# Altium project RK3566.PrjPcb (part 3 of 3)

## Sheet POWER_PMIC.SchDoc
size A3; SheetNumber: 11; SheetTotal: 20
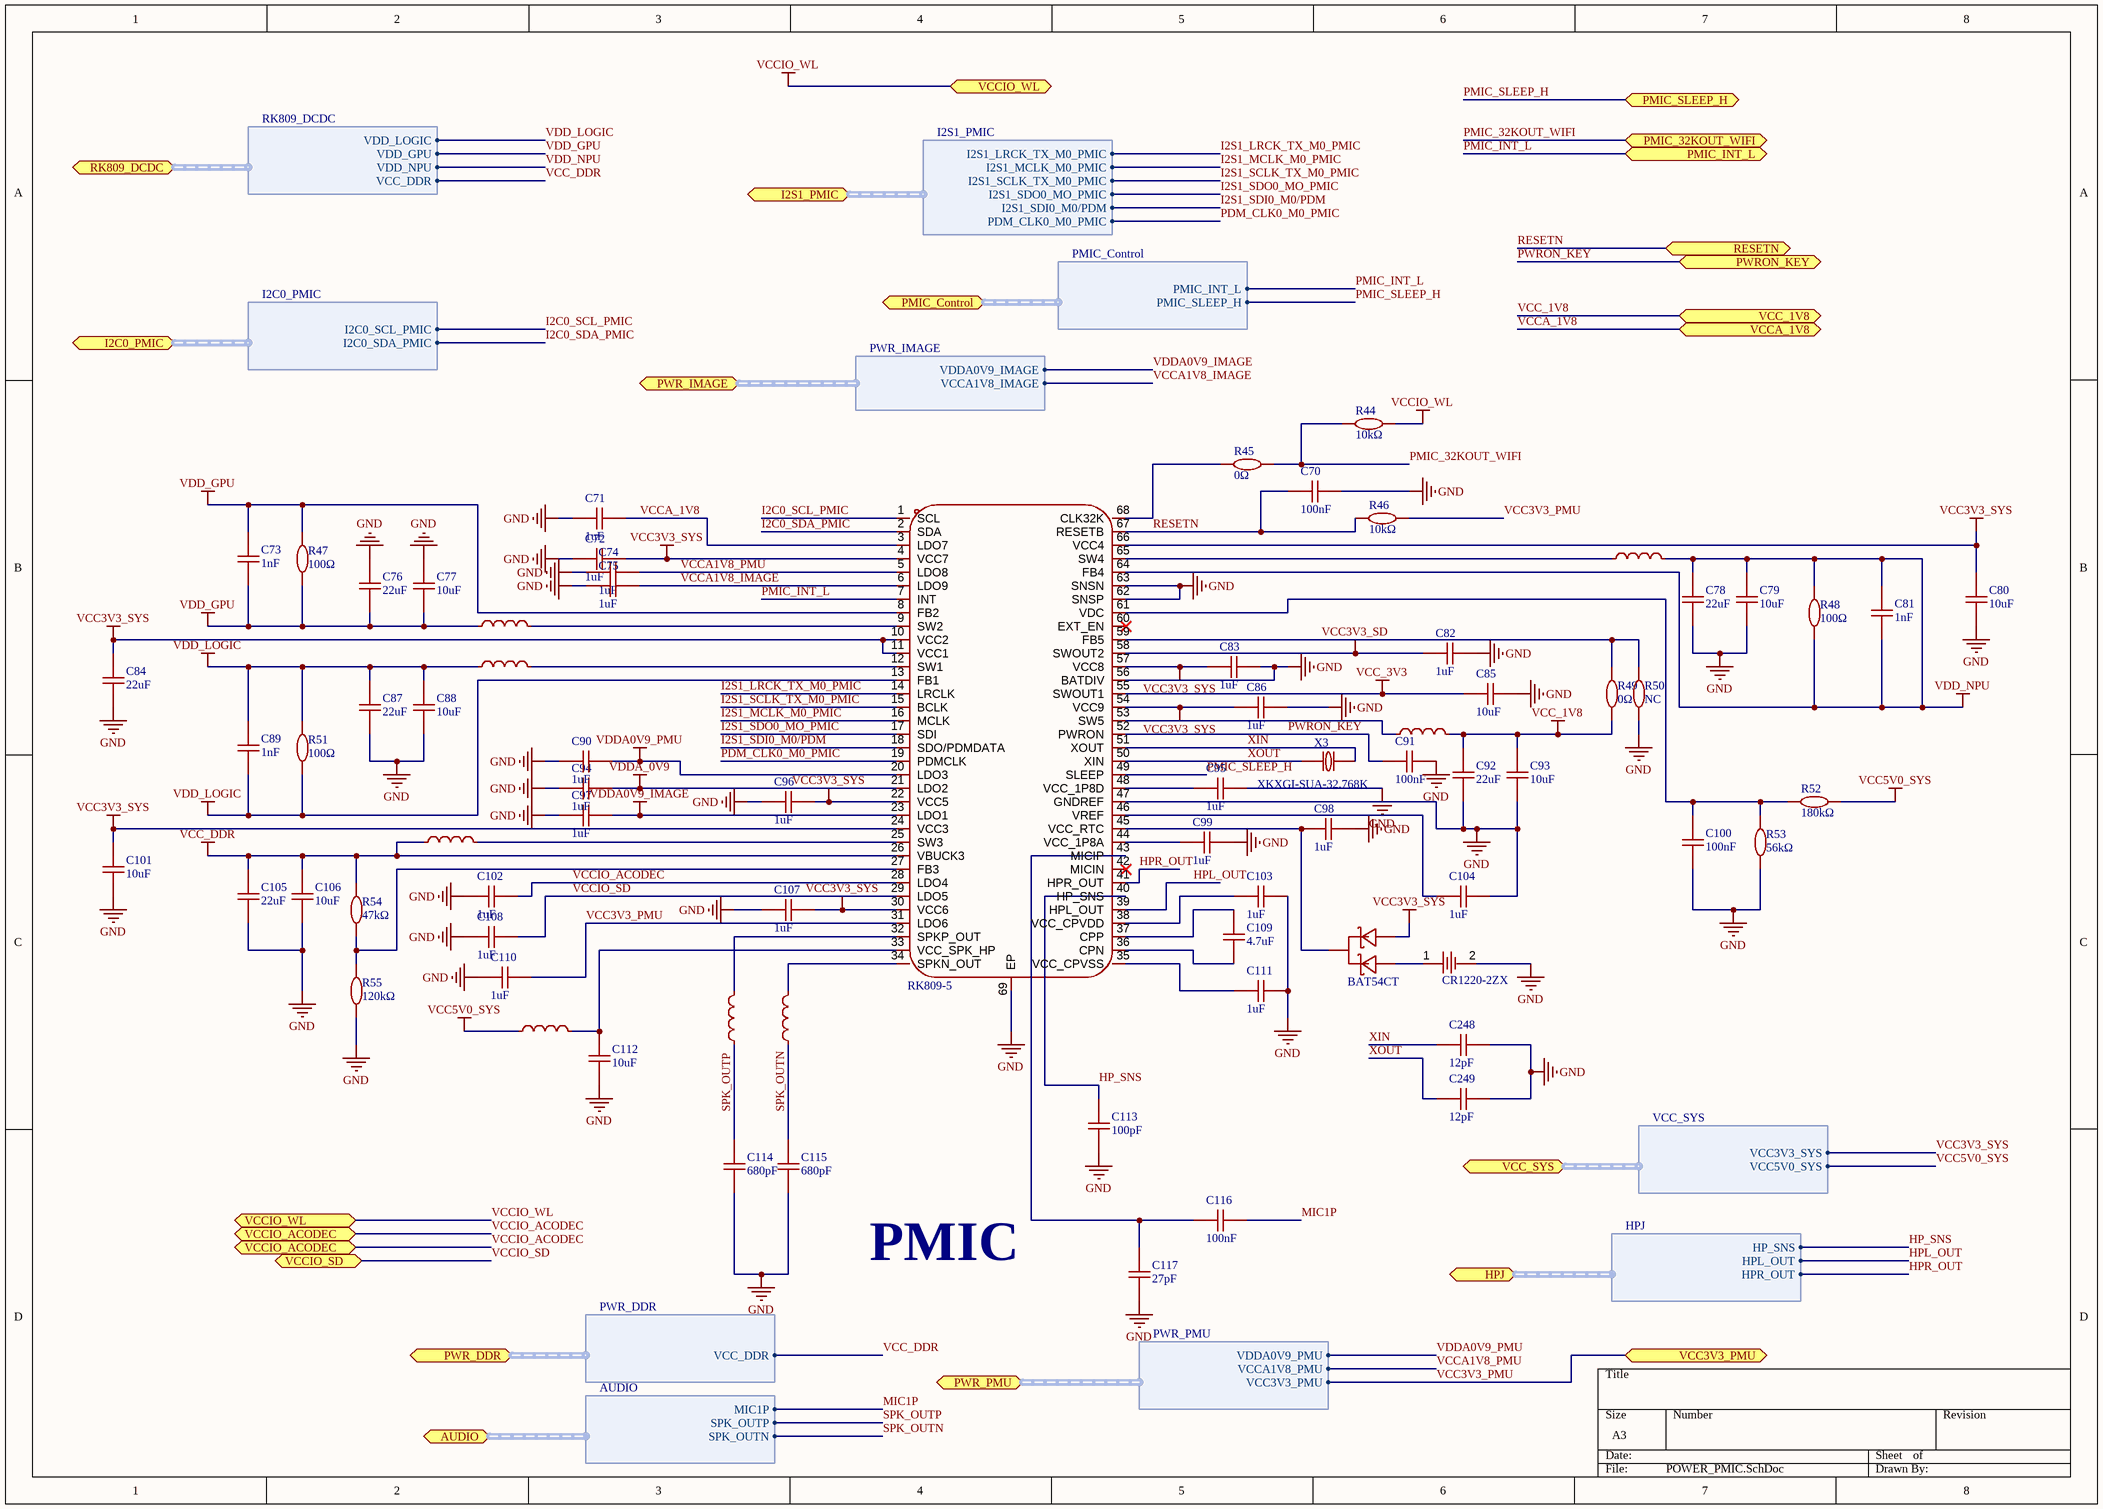
[diagram p14: POWER_PMIC.SchDoc]

### Parts
BT1  CR1220-2ZX  [BAT-SMD_CR1220-2ZX]
C70  100nF  [C0402]
C71  1uF  [C0402]
C72  1uF  [C0402]
C73  1nF  [C0402]
C74  1uF  [C0402]
C75  1uF  [C0402]
C76  22uF  [C0603]
C77  10uF  [C0603]
C78  22uF  [C0603]
C79  10uF  [C0603]
C80  10uF  [C0603]
C81  1nF  [C0402]
C82  1uF  [C0402]
C83  1uF  [C0402]
C84  22uF  [C0603]
C85  10uF  [C0603]
C86  1uF  [C0402]
C87  22uF  [C0603]
C88  10uF  [C0603]
C89  1nF  [C0402]
C90  1uF  [C0402]
C91  100nF  [C0402]
C92  22uF  [C0603]
C93  10uF  [C0603]
C94  1uF  [C0402]
C95  1uF  [C0402]
C96  1uF  [C0402]
C97  1uF  [C0402]
C98  1uF  [C0402]
C99  1uF  [C0402]
C100  100nF  [C0402]
C101  10uF  [C0603]
C102  1uF  [C0402]
C103  1uF  [C0402]
C104  1uF  [C0402]
C105  22uF  [C0603]
C106  10uF  [C0603]
C107  1uF  [C0402]
C108  1uF  [C0402]
C109  4.7uF  [C0402]
C110  1uF  [C0402]
C111  1uF  [C0402]
C112  10uF  [C0603]
C113  100pF  [C0402]
C114  680pF  [C0402]
C115  680pF  [C0402]
C116  100nF  [C0402]
C117  27pF  [C0402]
C248  12pF  [C0402]
C249  12pF  [C0402]
D9  BAT54CT  [SOT-523-3_L1.6-W0.8-P1.00-LS1.6-BR]
L3  470nH  [IND-SMD_L2.0-W1.6_MHCHL201610A-1R0M-Q8A]  (value not drawn)
L4  470nH  [IND-SMD_L2.0-W1.6_MHCHL201610A-1R0M-Q8A]  (value not drawn)
L5  470nH  [IND-SMD_L2.0-W1.6_MHCHL201610A-1R0M-Q8A]  (value not drawn)
L6  470nH  [IND-SMD_L2.0-W1.6_MHCHL201610A-1R0M-Q8A]  (value not drawn)
L7  470nH  [IND-SMD_L2.0-W1.6_MHCHL201610A-1R0M-Q8A]  (value not drawn)
L8  180Ω  [L0603]  (value not drawn)
L9  180Ω  [L0603]  (value not drawn)
L10  180Ω  [L0603]  (value not drawn)
R44  10kΩ  [R0402]
R45  0Ω  [R0402]
R46  10kΩ  [R0402]
R47  100Ω  [R0402]
R48  100Ω  [R0402]
R49  0Ω  [R0402]
R50  NC  [R0402]
R51  100Ω  [R0402]
R52  180kΩ  [R0402]
R53  56kΩ  [R0402]
R54  47kΩ  [R0402]
R55  120kΩ  [R0402]
U20  RK809-5  [QFN-68_L7.0-W7.0-P0.35-BL-EP5.5]
X3  XKXGI-SUA-32.768K  [CRYSTAL-SMD_L3.2-W1.5-1]

### Ports
AUDIO (bidir, harness AUDIO, see POWER[3D], Audio_AND_HPJ[1A], POWER[3D]), HPJ (bidir, harness HPJ, see POWER[3D], Audio_AND_HPJ[3C], POWER[3D]), I2C0_PMIC (bidir, harness I2C0_PMIC, see POWER[4C], POWER[4D], POWER_EXTENSION[4A], RK3566[3D], RK3566_OSC_PLL_PMUO1_2[5A]), I2S1_PMIC (bidir, harness I2S1_PMIC, see POWER[2D], RK3566[3B], RK3566_FLASH_SD_SARADC[6C]), PMIC_32KOUT_WIFI (bidir, see POWER[3D], Wi-Fi_BT[6C]), PMIC_Control (bidir, harness PMIC_Control, see POWER[3D], RK3566[3D], RK3566_OSC_PLL_PMUO1_2[1A]), PMIC_INT_L (bidir, see POWER[3D], RK3566[3D], RK3566_OSC_PLL_PMUO1_2[2B]), PMIC_SLEEP_H (bidir, see POWER[4C], POWER[4D], POWER_EXTENSION[1A], RK3566[3D], RK3566_OSC_PLL_PMUO1_2[2B]), PWR_DDR (bidir, harness PWR_DDR, see POWER[3D], POWER_FLASH_POWER_MANAGE[3B], RK3566[2A], RK3566_DDR_PHY[1A]), PWR_IMAGE (bidir, harness PWR_IMAGE, see POWER[2C], POWER[1C], RK3566[3C], RK3566_MIPI_HDMI[5D], RK3566_USB_GPIO[1B]), PWR_PMU (bidir, harness PWR_PMU, see POWER[2D], LPDDR4[4C], POWER[2D], RK3566[3C], RK3566_OSC_PLL_PMUO1_2[1A]), PWRON_KEY (bidir, see POWER[2C], DEBUG_AND_GPIO[8B], POWER[1C]), RESETN (bidir, see POWER[2C], DEBUG_AND_GPIO[8D], POWER[1C], RK3566[3C], RK3566_OSC_PLL_PMUO1_2[2B]), RK809_DCDC (bidir, harness RK809_DCDC, see POWER[3D], RK3566[3D], RK3566_POWER[2A]), VCC3V3_PMU (bidir, see POWER[3C], POWER_EXTENSION[1A], POWER_FLASH_POWER_MANAGE[3A]), VCC_1V8 (bidir, see POWER[3C], POWER_FLASH_POWER_MANAGE[3A]), VCC_SYS (bidir, harness VCC_SYS, see POWER[3C], Audio_AND_HPJ[3A], DEBUG_AND_GPIO[1D], HDMI[2C], MIPI_DSI_TP[6A], POWER[3B], POWER[6B], POWER_EXTENSION[4D], POWER_FLASH_POWER_MANAGE[3C], Wi-Fi_BT[3D]), VCCA_1V8 (bidir, see POWER[2C], DEBUG_AND_GPIO[5C], POWER[1C], RK3566[3C], RK3566_USB_GPIO[6C]), VCCIO_ACODEC (bidir, see POWER[3D], RK3566[3B], RK3566_FLASH_SD_SARADC[7C]), VCCIO_SD (bidir, see POWER[3D], RK3566[3B], RK3566_FLASH_SD_SARADC[7C]), VCCIO_WL (bidir, see POWER[4C], POWER[4D], POWER_EXTENSION[1A], RK3566[3B], RK3566_FLASH_SD_SARADC[7C])

### Harnesses
RK809_DCDC: VDD_LOGIC, VDD_GPU, VDD_NPU, VCC_DDR
I2C0_PMIC: I2C0_SCL_PMIC, I2C0_SDA_PMIC
I2S1_PMIC: I2S1_MCLK_M0_PMIC, I2S1_SCLK_TX_M0_PMIC, I2S1_SDO0_MO_PMIC, I2S1_SDI0_M0/PDM, I2S1_LRCK_TX_M0_PMIC, PDM_CLK0_M0_PMIC
PMIC_Control: PMIC_INT_L, PMIC_SLEEP_H
AUDIO: SPK_OUTP, SPK_OUTN, MIC1P
HPJ: HPL_OUT, HPR_OUT, HP_SNS
PWR_DDR: VCC_DDR
PWR_IMAGE: VDDA0V9_IMAGE, VCCA1V8_IMAGE
PWR_PMU: VCCA1V8_PMU, VDDA0V9_PMU, VCC3V3_PMU
VCC_SYS: VCC3V3_SYS, VCC5V0_SYS

### Nets
GND: BT1.2 C70.2 C71.2 C72.2 C74.2 C75.2 C76.2 C77.2 C78.1 C79.1 C80.1 C82.1 C83.2 C84.1 C85.1 C86.2 C87.1 C88.1 C90.2 C91.2 C92.1 C93.1 C94.2 C95.2 C96.2 C97.2 C98.1 C99.2 C100.1 C101.1 C102.2 C103.1 C104.1 C105.1 C106.1 C107.2 C108.2 C110.2 C111.2 C112.1 C113.1 C114.1 C115.1 C117.1 C248.2 C249.2 R50.2 R53.1 R55.1 U20.47(GNDREF) U20.56(BATDIV) U20.62(SNSP) U20.63(SNSN) U20.69(EP)
VCC3V3_PMU: C110.1 R46.2 U20.31(LDO6) ; port VCC3V3_PMU, port PWR_PMU.VCC3V3_PMU
VCC3V3_SD: C82.2 U20.58(SWOUT2)
VCC3V3_SYS: C72.1 C80.2 C83.1 C84.2 C86.1 C96.1 C101.2 C107.1 D9.2(A) U20.4(VCC7) U20.10(VCC2) U20.11(VCC1) U20.22(VCC5) U20.24(VCC3) U20.30(VCC6) U20.54(VCC9) U20.57(VCC8) U20.66(VCC4) ; port VCC_SYS.VCC3V3_SYS
VCC5V0_SYS: L10.1 R52.2 ; port VCC_SYS.VCC5V0_SYS
VCC_1V8: C92.2 C93.2 L6.2 R49.1 ; port VCC_1V8
VCC_3V3: C85.2 U20.55(SWOUT1)
VCC_DDR: C105.2 C106.2 L7.1 R54.2 U20.26(VBUCK3) ; port RK809_DCDC.VCC_DDR, port PWR_DDR.VCC_DDR
VCCA1V8_IMAGE: C75.1 U20.6(LDO9) ; port PWR_IMAGE.VCCA1V8_IMAGE
VCCA1V8_PMU: C74.1 U20.5(LDO8) ; port PWR_PMU.VCCA1V8_PMU
VCCA_1V8: C71.1 U20.3(LDO7) ; port VCCA_1V8
VCCIO_ACODEC: C102.1 U20.28(LDO4) ; port VCCIO_ACODEC
VCCIO_SD: C108.1 U20.29(LDO5) ; port VCCIO_SD
VCCIO_WL: R44.2 ; port VCCIO_WL
VDD_GPU: C73.1 C73.2 C76.1 C77.1 L4.1 R47.1 R47.2 U20.8(FB2) ; port RK809_DCDC.VDD_GPU
VDD_LOGIC: C87.2 C88.2 C89.1 C89.2 L5.1 R51.1 R51.2 U20.13(FB1) ; port RK809_DCDC.VDD_LOGIC
VDD_NPU: C78.2 C79.2 C81.1 C81.2 L3.2 R48.1 R48.2 U20.64(FB4) ; port RK809_DCDC.VDD_NPU
VDDA0V9_IMAGE: C97.1 U20.23(LDO1) ; port PWR_IMAGE.VDDA0V9_IMAGE
VDDA0V9_PMU: C90.1 U20.20(LDO3) ; port PWR_PMU.VDDA0V9_PMU
VDDA_0V9: C94.1 U20.21(LDO2)
HP_SNS: C113.2 U20.40(HP_SNS) ; port HPJ.HP_SNS
HPL_OUT: U20.39(HPL_OUT) ; port HPJ.HPL_OUT
HPR_OUT: U20.41(HPR_OUT) ; port HPJ.HPR_OUT
I2C0_SCL_PMIC: U20.1(SCL) ; port I2C0_PMIC.I2C0_SCL_PMIC
I2C0_SDA_PMIC: U20.2(SDA) ; port I2C0_PMIC.I2C0_SDA_PMIC
I2S1_LRCK_TX_M0_PMIC: U20.14(LRCLK) ; port I2S1_PMIC.I2S1_LRCK_TX_M0_PMIC
I2S1_MCLK_M0_PMIC: U20.16(MCLK) ; port I2S1_PMIC.I2S1_MCLK_M0_PMIC
I2S1_SCLK_TX_M0_PMIC: U20.15(BCLK) ; port I2S1_PMIC.I2S1_SCLK_TX_M0_PMIC
I2S1_SDI0_M0/PDM: U20.18(SDO/PDMDATA) ; port I2S1_PMIC.I2S1_SDI0_M0/PDM
I2S1_SDO0_MO_PMIC: U20.17(SDI) ; port I2S1_PMIC.I2S1_SDO0_MO_PMIC
MIC1P: C116.2 ; port AUDIO.MIC1P
PDM_CLK0_M0_PMIC: U20.19(PDMCLK) ; port I2S1_PMIC.PDM_CLK0_M0_PMIC
PMIC_32KOUT_WIFI: R44.1 R45.2 ; port PMIC_32KOUT_WIFI
PMIC_INT_L: U20.7(INT) ; port PMIC_INT_L, port PMIC_Control.PMIC_INT_L
PMIC_SLEEP_H: U20.49(SLEEP) ; port PMIC_SLEEP_H, port PMIC_Control.PMIC_SLEEP_H
PWRON_KEY: C91.1 U20.52(PWRON) ; port PWRON_KEY
RESETN: C70.1 R46.1 U20.67(RESETB) ; port RESETN
SPK_OUTN: C115.2 L9.1 ; port AUDIO.SPK_OUTN
SPK_OUTP: C114.2 L8.1 ; port AUDIO.SPK_OUTP
XIN: C248.1 U20.51(XOUT) X3.2
XOUT: C249.1 U20.50(XIN) X3.1
NetBT1_1: BT1.1 D9.1(A)
NetC95_1: C95.1 U20.48(VCC_1P8D)
NetC98_2: C98.2 D9.3(K) U20.45(VCC_RTC)
NetC99_1: C99.1 U20.44(VCC_1P8A)
NetC100_2: C100.2 R52.1 R53.2 U20.61(VDC)
NetC103_2: C103.2 U20.38(VCC_CPVDD)
NetC104_2: C104.2 U20.46(VREF)
NetC109_1: C109.1 U20.36(CPN)
NetC109_2: C109.2 U20.37(CPP)
NetC111_1: C111.1 U20.35(VCC_CPVSS)
NetC112_2: C112.2 L10.2 U20.33(VCC_SPK_HP)
NetC116_1: C116.1 C117.2 U20.43(MICIP)
NetL3_1: L3.1 U20.65(SW4)
NetL4_2: L4.2 U20.9(SW2)
NetL5_2: L5.2 U20.12(SW1)
NetL6_1: L6.1 U20.53(SW5)
NetL7_2: L7.2 U20.25(SW3)
NetL8_2: L8.2 U20.32(SPKP_OUT)
NetL9_2: L9.2 U20.34(SPKN_OUT)
NetR45_1: R45.1 U20.68(CLK32K)
NetR49_2: R49.2 R50.1 U20.59(FB5)
NetR54_1: R54.1 R55.2 U20.27(FB3)

Not connected (* = marked no-connect by the designer): U20 42(MICIN)* 60(EXT_EN)*

### Notes on the sheet
- PMIC

### Library data of the parts
BT1 = CR1220-2ZX: Battery; Symbol: CR1220-2ZX
C70 C91 C100 C116 = 100nF: 50V 100nF X7R ±10% 0402 Ceramic Capacitors ROHS
C71 C72 C74 C75 C82 C83 C86 C90 C94-C99 C102-C104 C107 C108 C110 C111 = 1uF: 50V 1uF X5R ±10% 0402 Ceramic Capacitors ROHS
C73 C81 C89 = 1nF: 50V 1nF X7R ±10% 0402 Ceramic Capacitors ROHS
C76 C78 C84 C87 C92 C105 = 22uF: 16V 22uF X5R ±20% 0603 Ceramic Capacitors ROHS
C77 C79 C80 C85 C88 C93 C101 C106 C112 = 10uF: 10V 10uF X5R ±10% 0603 Ceramic Capacitors ROHS
C109 = 4.7uF: 10V 4.7uF X5R ±20% 0402 Ceramic Capacitors ROHS
C113 = 100pF: 50V 100pF C0G ±5% 0402 Ceramic Capacitors ROHS
C114 C115 = 680pF: 50V 680pF C0G ±5% 0402 Ceramic Capacitors ROHS
C117 = 27pF: 50V 27pF C0G ±5% 0402 Ceramic Capacitors ROHS
C248 C249 = 12pF: 50V 12pF C0G ±5% 0402 Ceramic Capacitors ROHS
D9 = BAT54CT: 电压:30V 电流:200mA 特性：低正向压降。 快速开关。 PN结保护环，用于瞬态和ESD保护; Symbol: BAT54CT
L3-L7 = MCS20FC-R47MHC: 0806 MCS20FC-R47MHC; Manufacturer: Sunltech(顺磁); Symbol: SLW4030S1R0NST; Add into BOM: yes; Value: 1uH; Tolerance: ±30%; Current Rating: 4.15A; DC Resistance(DCR): 18mΩ; Device: SLW4030S1R0NST; LCSC Part Name: 1uH ±30%; Supplier Part: C206354; Manufacturer Part: SLW4030S1R0NST; Supplier Footprint: SMD,4x4mm; JLCPCB Part Class: Extended Part; Datasheet: https://item.szlcsc.com/datasheet/SLW4030S1R0NST/207399.html; Supplier: LCSC; Convert to PCB: yes
L8-L10 = BLM18PG181SN1D: 单路 0603磁珠 阻抗180Ω@100MHz; Manufacturer: cjiang(长江微电); Symbol: FNR6020S4R7MT; Add into BOM: yes; Value: 4.7uH; Tolerance: ±20%; Saturation Current (Isat): 3.6A; DC Resistance (DCR): 75mΩ; Device: FNR6020S4R7MT; LCSC Part Name: 4.7uH ±20% 3.6A; Supplier Part: C168008; Manufacturer Part: FNR6020S4R7MT; Supplier Footprint: SMD,6x6mm; JLCPCB Part Class: Extended Part; Datasheet: https://atta.szlcsc.com/upload/public/pdf/source/20190327/C167925_9EFF0AABC4CA629C2CC95961DBF7D39D.pdf; Supplier: LCSC; Convert to PCB: yes
R44 R46 = 10kΩ: 62.5mW 10kΩ 50V ±100ppm/℃ Thick Film Resistor ±1% 0402 Chip Resistor - Surface Mount ROHS
R45 R49 R50 = 0Ω: 0Ω 62.5mW 50V Thick Film Resistor ±1% 0402 Chip Resistor - Surface Mount ROHS
R47 R48 R51 = 100Ω: 100Ω 62.5mW 50V ±100ppm/℃ Thick Film Resistor ±1% 0402 Chip Resistor - Surface Mount ROHS
R52 = 180kΩ: 62.5mW 180kΩ 50V ±100ppm/℃ Thick Film Resistor ±1% 0402 Chip Resistor - Surface Mount ROHS
R53 = 56kΩ: 56kΩ 62.5mW 50V ±100ppm/℃ Thick Film Resistor ±1% 0402 Chip Resistor - Surface Mount ROHS
R54 = 47kΩ: 62.5mW 47kΩ 50V ±100ppm/℃ Thick Film Resistor ±1% 0402 Chip Resistor - Surface Mount ROHS
R55 = 120kΩ: 62.5mW 120kΩ 50V ±100ppm/℃ Thick Film Resistor ±1% 0402 Chip Resistor - Surface Mount ROHS
X3 = XKXGI-SUA-32.768K: SMD3215-2P XKXGI-SUA-32.768K
U20 = RK809-5: Symbol: RK809-5

## Sheet POWER_EXTENSION.SchDoc
size A3; SheetNumber: 12; SheetTotal: 20
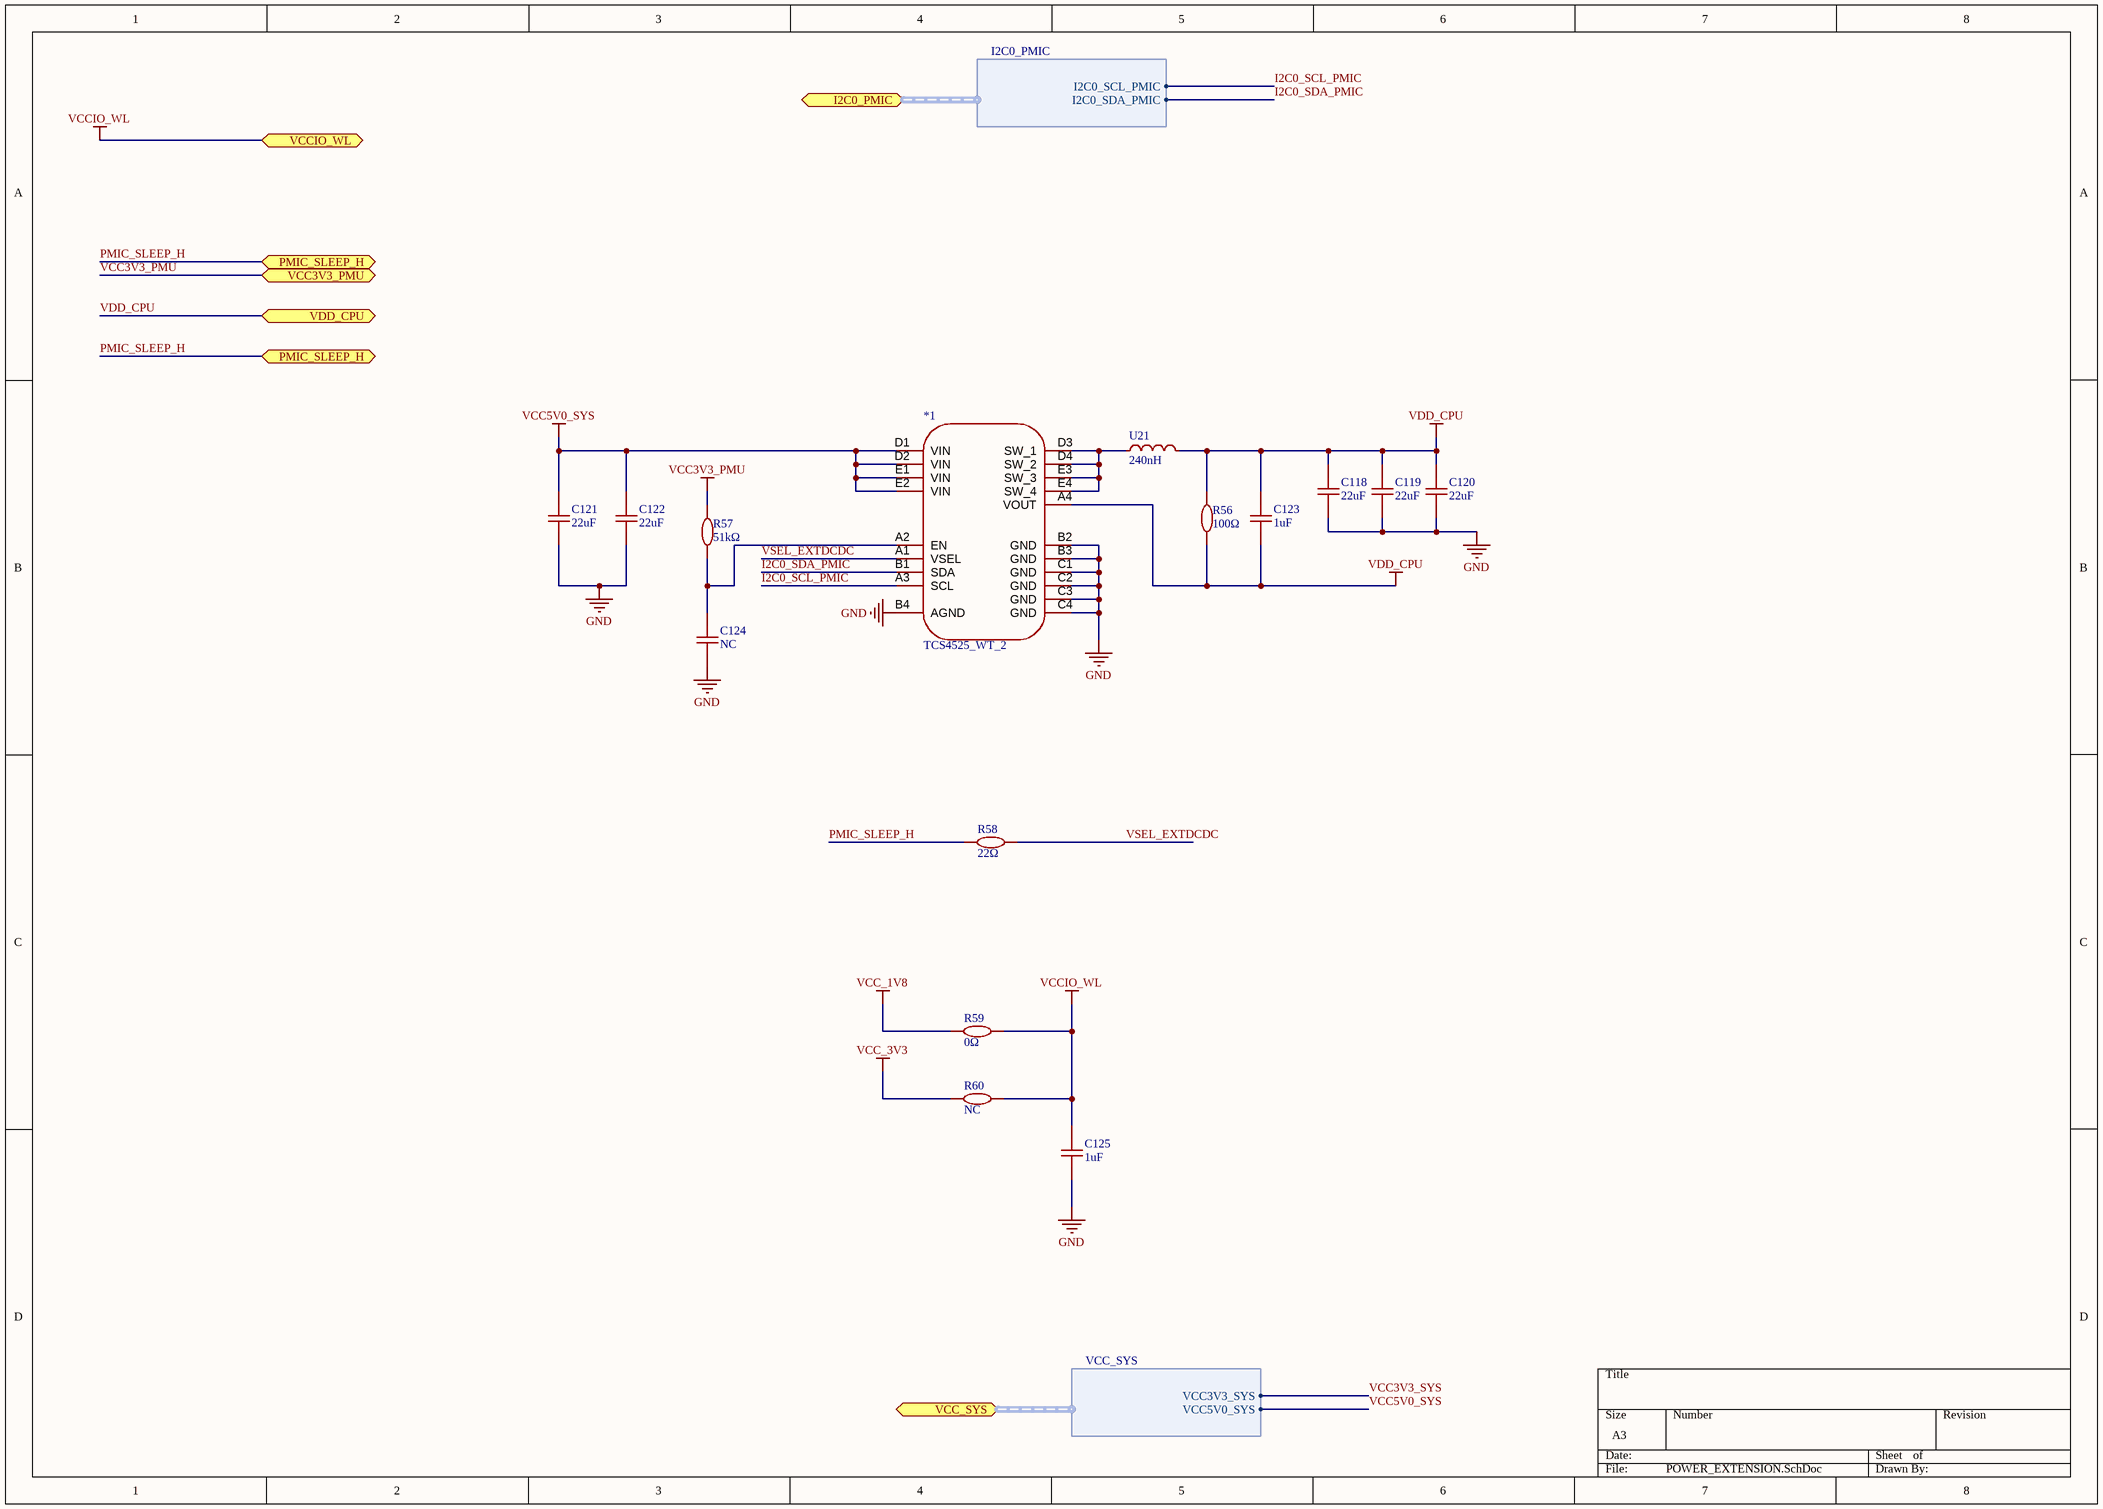
[diagram p15: POWER_EXTENSION.SchDoc]

### Parts
*1  TCS4525_WT_2  [TCS4525]
C118  22uF  [C0603]
C119  22uF  [C0603]
C120  22uF  [C0603]
C121  22uF  [C0603]
C122  22uF  [C0603]
C123  1uF  [C0402]
C124  NC  [C0402]
C125  1uF  [C0402]
R56  100Ω  [R0402]
R57  51kΩ  [R0402]
R58  22Ω  [R0402]
R59  0Ω  [R0402]
R60  NC  [R0402]
U21  240nH  [IND-SMD_L2.5-W2.0_WPN252012H]

### Ports
I2C0_PMIC (bidir, harness I2C0_PMIC, see POWER[4C], POWER[4D], POWER_PMIC[1A], RK3566[3D], RK3566_OSC_PLL_PMUO1_2[5A]), PMIC_SLEEP_H (bidir, see POWER[4C], POWER[4D], POWER_PMIC[7A], RK3566[3D], RK3566_OSC_PLL_PMUO1_2[2B]), VCC3V3_PMU (bidir, see POWER[5C], POWER_FLASH_POWER_MANAGE[3A], POWER_PMIC[7D]), VCC_SYS (bidir, harness VCC_SYS, see POWER[5C], Audio_AND_HPJ[3A], DEBUG_AND_GPIO[1D], HDMI[2C], MIPI_DSI_TP[6A], POWER[3B], POWER[6B], POWER_FLASH_POWER_MANAGE[3C], POWER_PMIC[6D], Wi-Fi_BT[3D]), VCCIO_WL (bidir, see POWER[4C], POWER[4D], POWER_PMIC[1D], POWER_PMIC[4A], RK3566[3B], RK3566_FLASH_SD_SARADC[7C]), VDD_CPU (bidir, see POWER[5D], RK3566[3D], RK3566_POWER[3A])

### Harnesses
I2C0_PMIC: I2C0_SCL_PMIC, I2C0_SDA_PMIC
VCC_SYS: VCC3V3_SYS, VCC5V0_SYS

### Nets
GND: *1.B2(GND) *1.B3(GND) *1.B4(AGND) *1.C1(GND) *1.C2(GND) *1.C3(GND) *1.C4(GND) C118.1 C119.1 C120.1 C121.1 C122.1 C124.1 C125.1
VCC3V3_PMU: R57.2 ; port VCC3V3_PMU
VCC5V0_SYS: *1.D1(VIN) *1.D2(VIN) *1.E1(VIN) *1.E2(VIN) C121.2 C122.2 ; port VCC_SYS.VCC5V0_SYS
VCC_1V8: R59.1
VCC_3V3: R60.1
VCCIO_WL: C125.2 R59.2 R60.2 ; port VCCIO_WL
VDD_CPU: *1.A4(VOUT) C118.2 C119.2 C120.2 C123.1 C123.2 R56.1 R56.2 U21.2 ; port VDD_CPU
I2C0_SCL_PMIC: *1.A3(SCL) ; port I2C0_PMIC.I2C0_SCL_PMIC
I2C0_SDA_PMIC: *1.B1(SDA) ; port I2C0_PMIC.I2C0_SDA_PMIC
PMIC_SLEEP_H: R58.1 ; port PMIC_SLEEP_H
VSEL_EXTDCDC: *1.A1(VSEL) R58.2
Net*1_A2: *1.A2(EN) C124.2 R57.1
Net*1_D3: *1.D3(SW_1) *1.D4(SW_2) *1.E3(SW_3) *1.E4(SW_4) U21.1

### Library data of the parts
*1 = TCS4525_WT_2: LDO from TaoBao
C118-C122 = 22uF: as C76 on sheet POWER_PMIC
C123 C125 = 1uF: as C71 on sheet POWER_PMIC
C124 = 1nF: as C73 on sheet POWER_PMIC
R56 = 100Ω: as R47 on sheet POWER_PMIC
R57 = 51kΩ: 51kΩ 62.5mW 50V ±100ppm/℃ Thick Film Resistor ±1% 0402 Chip Resistor - Surface Mount ROHS
R58 = 22Ω: 小尺寸、重量轻。降低组装成本,与贴片机匹配。适用于波峰焊和回流焊
R59 R60 = 0Ω: as R45 on sheet POWER_PMIC
U21 = WPN252012HR24MT

## Sheet POWER_FLASH_POWER_MANAGE.SchDoc
size A4; SheetNumber: 13; SheetTotal: 20
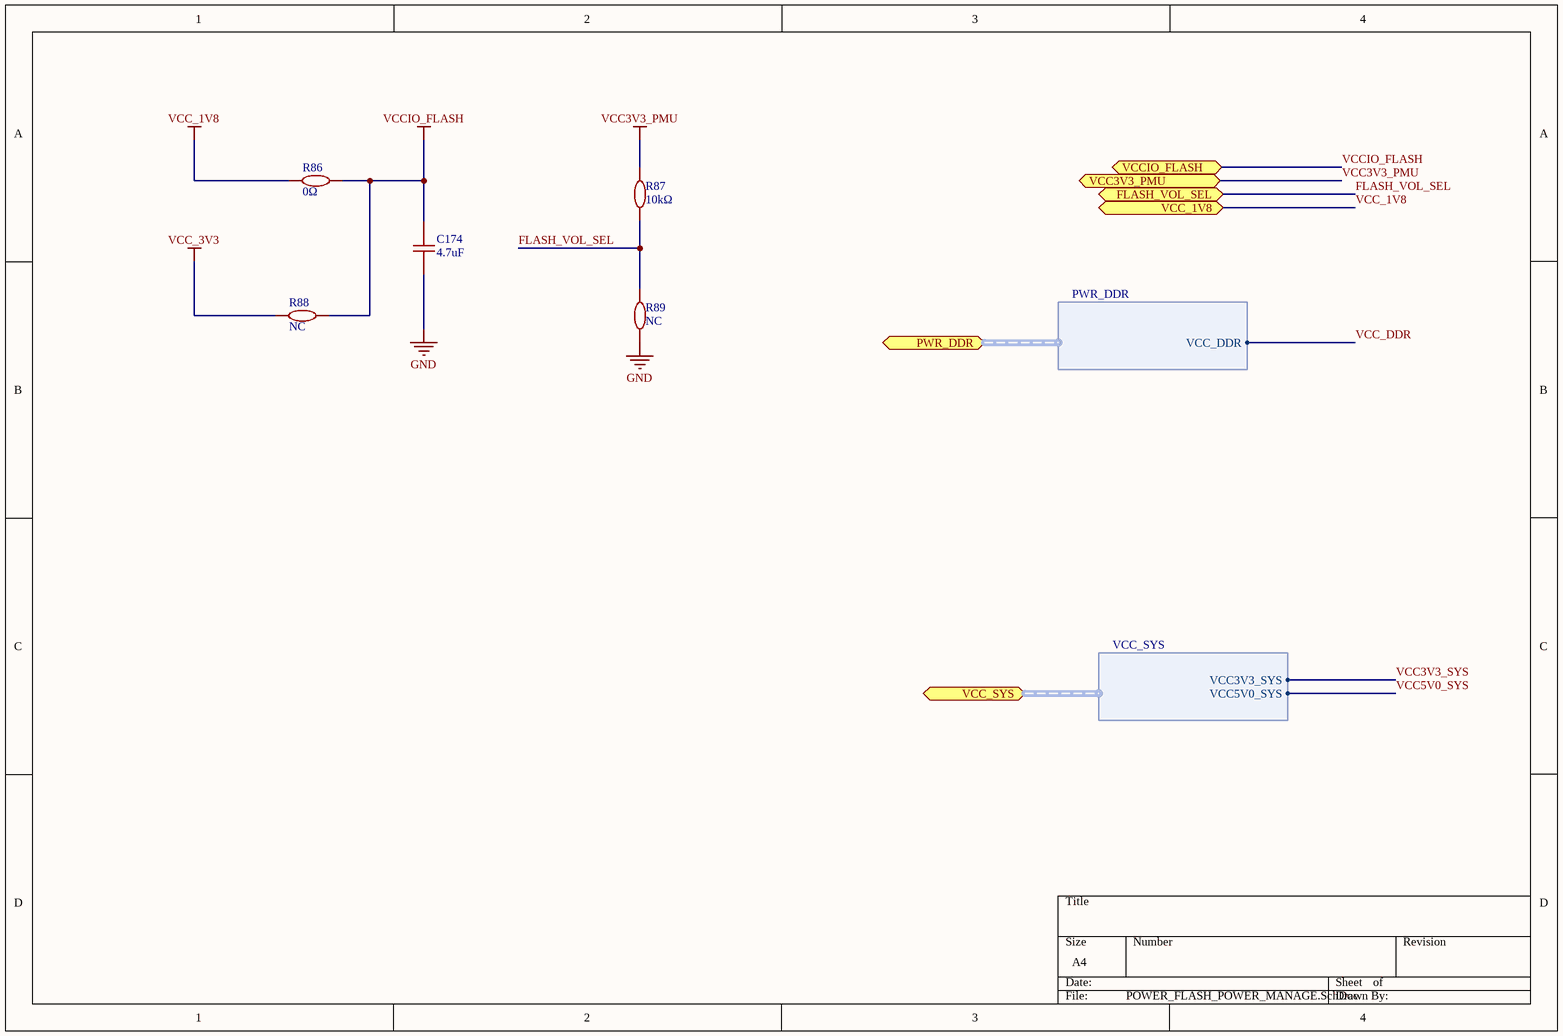
[diagram p16: POWER_FLASH_POWER_MANAGE.SchDoc]

### Parts
C174  4.7uF  [C0402]
R86  0Ω  [R0402]
R87  10kΩ  [R0402]
R88  NC  [R0402]
R89  NC  [R0402]

### Ports
FLASH_VOL_SEL (bidir, see POWER[6D], RK3566[3D], RK3566_OSC_PLL_PMUO1_2[2B]), PWR_DDR (bidir, harness PWR_DDR, see POWER[6D], POWER[3D], POWER_PMIC[2D], RK3566[2A], RK3566_DDR_PHY[1A]), VCC3V3_PMU (bidir, see POWER[7C], POWER_EXTENSION[1A], POWER_PMIC[7D]), VCC_1V8 (bidir, see POWER[7C], POWER_PMIC[7A]), VCC_SYS (bidir, harness VCC_SYS, see POWER[7C], Audio_AND_HPJ[3A], DEBUG_AND_GPIO[1D], HDMI[2C], MIPI_DSI_TP[6A], POWER[3B], POWER[6B], POWER_EXTENSION[4D], POWER_PMIC[6D], Wi-Fi_BT[3D]), VCCIO_FLASH (bidir, see POWER[7D], RK3566[3B], RK3566_FLASH_SD_SARADC[7C])

### Harnesses
PWR_DDR: VCC_DDR
VCC_SYS: VCC3V3_SYS, VCC5V0_SYS

### Nets
GND: C174.1 R89.1
VCC3V3_PMU: R87.2 ; port VCC3V3_PMU
VCC_1V8: R86.1 ; port VCC_1V8
VCC_3V3: R88.1
VCCIO_FLASH: C174.2 R86.2 R88.2 ; port VCCIO_FLASH
FLASH_VOL_SEL: R87.1 R89.2 ; port FLASH_VOL_SEL

### Library data of the parts
C174 = 4.7uF: as C109 on sheet POWER_PMIC
R86 R88 R89 = 0Ω: as R45 on sheet POWER_PMIC
R87 = 10kΩ: as R44 on sheet POWER_PMIC

## Sheet Audio_AND_HPJ.SchDoc
size A4; SheetNumber: 4; SheetTotal: 20
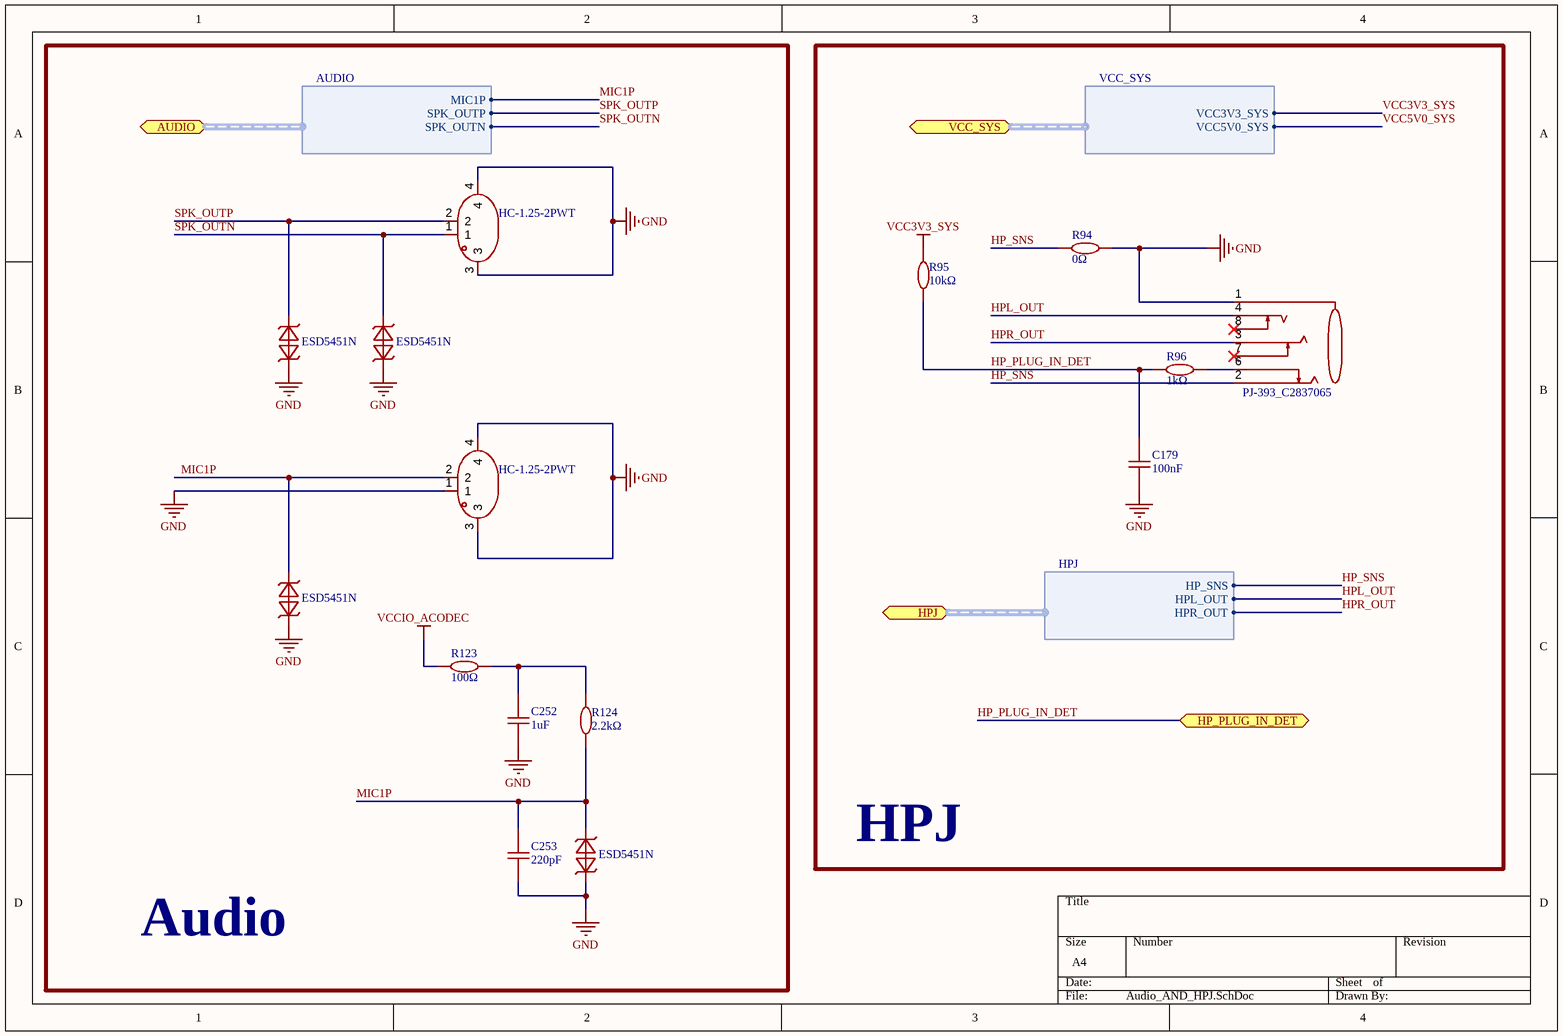
[diagram p17: Audio_AND_HPJ.SchDoc]

### Parts
AUDIO1  PJ-393_C2837065  [AUDIO-SMD_PJ-393]
C179  100nF  [C0402]
C252  1uF  [C0402]
C253  220pF  [C0402]
CN3  HC-1.25-2PWT  [CONN-SMD_2P-P1.25-HC-1.25-2PWT]
CN4  HC-1.25-2PWT  [CONN-SMD_2P-P1.25-HC-1.25-2PWT]
R94  0Ω  [R0402]
R95  10kΩ  [R0402]
R96  1kΩ  [R0402]
R123  100Ω  [R0402]
R124  2.2kΩ  [R0402]
U23  ESD5451N  [DFN1006-2L-BI]
U24  ESD5451N  [DFN1006-2L-BI]
U25  ESD5451N  [DFN1006-2L-BI]
U26  ESD5451N  [DFN1006-2L-BI]

### Blocks framed on the sheet
Audio: C252 C253 CN3 CN4 R123 R124 U23-U26
HPJ: AUDIO1 C179 R94-R96

### Ports
AUDIO (bidir, harness AUDIO, see Overview[2B], POWER[3D], POWER_PMIC[2D]), HP_PLUG_IN_DET (bidir, see Overview[2B], RK3566[3C], RK3566_OSC_PLL_PMUO1_2[7C]), HPJ (bidir, harness HPJ, see Overview[2B], POWER[3D], POWER_PMIC[6D]), VCC_SYS (bidir, harness VCC_SYS, see Overview[2B], DEBUG_AND_GPIO[1D], HDMI[2C], MIPI_DSI_TP[6A], POWER[3B], POWER[6B], POWER_EXTENSION[4D], POWER_FLASH_POWER_MANAGE[3C], POWER_PMIC[6D], Wi-Fi_BT[3D])

### Harnesses
AUDIO: SPK_OUTP, SPK_OUTN, MIC1P
HPJ: HPL_OUT, HPR_OUT, HP_SNS
VCC_SYS: VCC3V3_SYS, VCC5V0_SYS

### Nets
GND: AUDIO1.1 C179.1 C252.1 C253.1 CN3.3 CN3.4 CN4.1 CN4.3 CN4.4 R94.2 U23.1 U24.1 U25.1 U26.1
VCC3V3_SYS: R95.2 ; port VCC_SYS.VCC3V3_SYS
VCCIO_ACODEC: R123.1
HP_PLUG_IN_DET: C179.2 R95.1 R96.1 ; port HP_PLUG_IN_DET
HP_SNS: AUDIO1.2 R94.1 ; port HPJ.HP_SNS
HPL_OUT: AUDIO1.4 ; port HPJ.HPL_OUT
HPR_OUT: AUDIO1.3 ; port HPJ.HPR_OUT
MIC1P: C253.2 CN4.2 R124.1 U25.2 U26.2 ; port AUDIO.MIC1P
SPK_OUTN: CN3.1 U24.2 ; port AUDIO.SPK_OUTN
SPK_OUTP: CN3.2 U23.2 ; port AUDIO.SPK_OUTP
NetAUDIO1_6: AUDIO1.6 R96.2
NetC252_2: C252.2 R123.2 R124.2

Not connected (* = marked no-connect by the designer): AUDIO1 7* 8*

### Library data of the parts
AUDIO1 = PJ-393_C2837065: 3.5mm耳机座 七脚四极带三组开关耳机插座；耐高温贴片耳机插座; Symbol: PJ-393_C2837065
C179 = 100nF: as C70 on sheet POWER_PMIC
C252 = 1uF: as C71 on sheet POWER_PMIC
C253 = 220pF: 16V 220pF X7R ±10% 0402 Ceramic Capacitors ROHS
CN3 CN4 = HC-1.25-2PWT: SMD,P=1.25mm,卧贴  1x2P 间距:1.25mm 卧贴 系列:PicoBlade(MX 1.25); Symbol: HC-1.25-2PWT
R94 = 0Ω: as R45 on sheet POWER_PMIC
R95 = 10kΩ: as R44 on sheet POWER_PMIC
R96 = 1kΩ: 1kΩ 62.5mW 50V ±100ppm/℃ Thick Film Resistor ±1% 0402 Chip Resistor - Surface Mount ROHS
R123 = 100Ω: as R47 on sheet POWER_PMIC
R124 = 2.2kΩ: 2.2kΩ ±1% 62.5mW 厚膜电阻
U23-U26 = ESD5451N: 是双向 TVS（瞬态电压抑制器），专门用于保护连接到低速数据线和控制线的敏感电子元件，使其免受 ESD（静电放电）、EFT（电快速瞬变）和浪涌引起的过应力影响。; Symbol: ESD5451N

## Sheet DEBUG_AND_GPIO.SchDoc
size A3; SheetNumber: 5; SheetTotal: 20
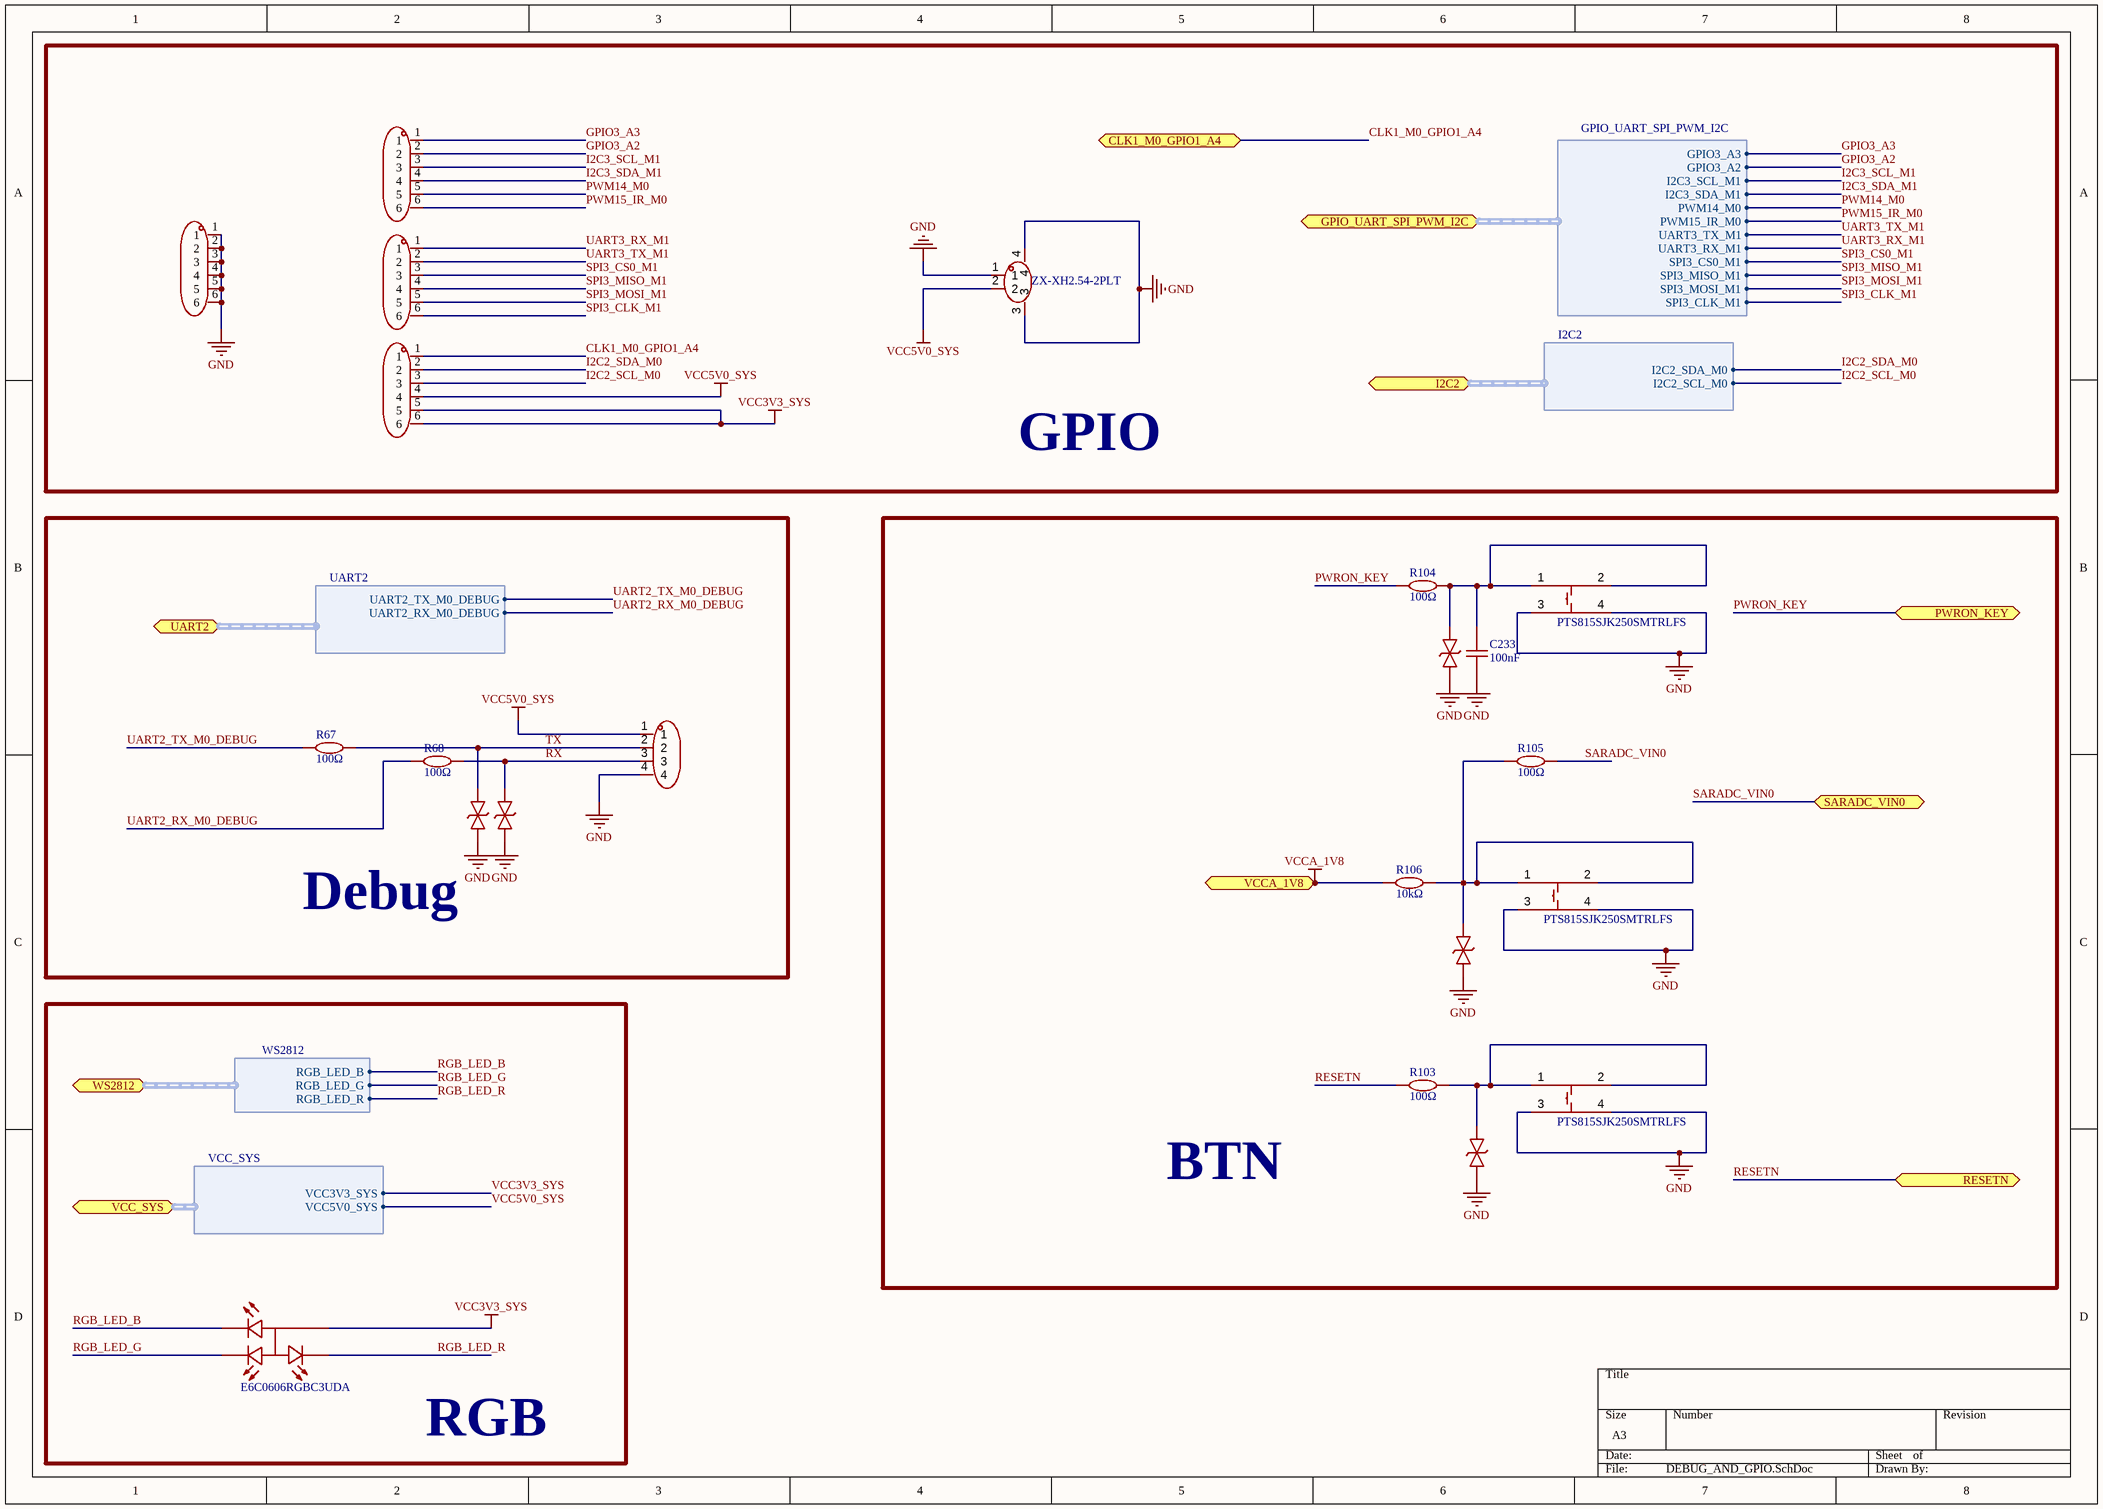
[diagram p18: DEBUG_AND_GPIO.SchDoc]

### Parts
C233  100nF  [C0402]
H1  4  [HDR-TH_4P-P2.54-V-M]  (value not drawn)
LED2  E6C0606RGBC3UDA  [LED-ARRAY-SMD_4P-L1.6-W1.6_SY-PB2333RGBC-010F]
R67  100Ω  [R0402]
R68  100Ω  [R0402]
R103  100Ω  [R0402]
R104  100Ω  [R0402]
R105  100Ω  [R0402]
R106  10kΩ  [R0402]
SW1  PTS815SJK250SMTRLFS  [SW-SMD_4P-L4.2-W3.3-P2.15-LS5.1]
SW2  PTS815SJK250SMTRLFS  [SW-SMD_4P-L4.2-W3.3-P2.15-LS5.1]
SW3  PTS815SJK250SMTRLFS  [SW-SMD_4P-L4.2-W3.3-P2.15-LS5.1]
U27  ZX-XH2.54-2PLT  [CONN-SMD_2P-P2.50_HCTL_HC-XH-2ALT]
U35  ESD5451N  [DFN1006-2L-BI]  (value not drawn)
U36  ESD5451N  [DFN1006-2L-BI]  (value not drawn)
U37  ESD5451N  [DFN1006-2L-BI]  (value not drawn)
U38  HX PZ2.54-1x6P ZZ  [HDR-TH_6P-P2.54-V-M]  (value not drawn)
U39  HX PZ2.54-1x6P ZZ  [HDR-TH_6P-P2.54-V-M]  (value not drawn)
U40  HX PZ2.54-1x6P ZZ  [HDR-TH_6P-P2.54-V-M]  (value not drawn)
U42  ESD5451N  [DFN1006-2L-BI]  (value not drawn)
U43  ESD5451N  [DFN1006-2L-BI]  (value not drawn)
U44  HX PZ2.54-1x6P ZZ  [HDR-TH_6P-P2.54-V-M]  (value not drawn)

### Blocks framed on the sheet
GPIO: U27 U38-U40 U44
Debug: H1 R67 R68 U42 U43
BTN: C233 R103-R106 SW1-SW3 U35-U37
RGB: LED2

### Ports
CLK1_M0_GPIO1_A4 (bidir, see Overview[2D], RK3566[3B], RK3566_FLASH_SD_SARADC[7C]), GPIO_UART_SPI_PWM_I2C (bidir, harness GPIO_UART_SPI_PWM_I2C, see Overview[2D], RK3566[3C], RK3566_USB_GPIO[6D]), I2C2 (bidir, harness I2C2, see Overview[2D], RK3566[3C], RK3566_OSC_PLL_PMUO1_2[5A]), PWRON_KEY (bidir, see Overview[2D], POWER[1C], POWER_PMIC[7A]), RESETN (bidir, see Overview[2D], POWER[1C], POWER_PMIC[7A], RK3566[3C], RK3566_OSC_PLL_PMUO1_2[2B]), SARADC_VIN0 (bidir, see Overview[2D], RK3566[3C], RK3566_USB_GPIO[7A]), UART2 (bidir, harness UART2, see Overview[2D], RK3566[3D], RK3566_OSC_PLL_PMUO1_2[5A]), VCC_SYS (bidir, harness VCC_SYS, see Overview[2D], Audio_AND_HPJ[3A], HDMI[2C], MIPI_DSI_TP[6A], POWER[3B], POWER[6B], POWER_EXTENSION[4D], POWER_FLASH_POWER_MANAGE[3C], POWER_PMIC[6D], Wi-Fi_BT[3D]), VCCA_1V8 (bidir, see Overview[2D], POWER[1C], POWER_PMIC[7A], RK3566[3C], RK3566_USB_GPIO[6C]), WS2812 (bidir, harness WS2812, see Overview[2D], RK3566[3B], RK3566_FLASH_SD_SARADC[6D])

### Harnesses
UART2: UART2_RX_M0_DEBUG, UART2_TX_M0_DEBUG
WS2812: RGB_LED_B, RGB_LED_G, RGB_LED_R
VCC_SYS: VCC3V3_SYS, VCC5V0_SYS
GPIO_UART_SPI_PWM_I2C: I2C3_SDA_M1, PWM14_M0, PWM15_IR_M0, I2C3_SCL_M1, GPIO3_A2, UART3_TX_M1, SPI3_CS0_M1, UART3_RX_M1, SPI3_MISO_M1, SPI3_MOSI_M1, SPI3_CLK_M1, GPIO3_A3
I2C2: I2C2_SDA_M0, I2C2_SCL_M0

### Nets
GND: C233.1 H1.4 SW1.3 SW1.4 SW2.3 SW2.4 SW3.3 SW3.4 U27.1 U27.3 U27.4 U35.1 U36.1 U37.1 U42.1 U43.1 U44.1 U44.2 U44.3 U44.4 U44.5 U44.6
VCC3V3_SYS: LED2.2(+) U40.5 U40.6 ; port VCC_SYS.VCC3V3_SYS
VCC5V0_SYS: H1.1 U27.2 U40.4 ; port VCC_SYS.VCC5V0_SYS
VCCA_1V8: R106.1 ; port VCCA_1V8
CLK1_M0_GPIO1_A4: U40.1 ; port CLK1_M0_GPIO1_A4
GPIO3_A2: U38.2 ; port GPIO_UART_SPI_PWM_I2C.GPIO3_A2
GPIO3_A3: U38.1 ; port GPIO_UART_SPI_PWM_I2C.GPIO3_A3
I2C2_SCL_M0: U40.3 ; port I2C2.I2C2_SCL_M0
I2C2_SDA_M0: U40.2 ; port I2C2.I2C2_SDA_M0
I2C3_SCL_M1: U38.3 ; port GPIO_UART_SPI_PWM_I2C.I2C3_SCL_M1
I2C3_SDA_M1: U38.4 ; port GPIO_UART_SPI_PWM_I2C.I2C3_SDA_M1
PWM14_M0: U38.5 ; port GPIO_UART_SPI_PWM_I2C.PWM14_M0
PWM15_IR_M0: U38.6 ; port GPIO_UART_SPI_PWM_I2C.PWM15_IR_M0
PWRON_KEY: R104.1 ; port PWRON_KEY
RESETN: R103.1 ; port RESETN
RGB_LED_B: LED2.1(-) ; port WS2812.RGB_LED_B
RGB_LED_G: LED2.3(-) ; port WS2812.RGB_LED_G
RGB_LED_R: LED2.4(-) ; port WS2812.RGB_LED_R
RX: H1.3 R68.2 U43.2
SARADC_VIN0: R105.2 ; port SARADC_VIN0
SPI3_CLK_M1: U39.6 ; port GPIO_UART_SPI_PWM_I2C.SPI3_CLK_M1
SPI3_CS0_M1: U39.3 ; port GPIO_UART_SPI_PWM_I2C.SPI3_CS0_M1
SPI3_MISO_M1: U39.4 ; port GPIO_UART_SPI_PWM_I2C.SPI3_MISO_M1
SPI3_MOSI_M1: U39.5 ; port GPIO_UART_SPI_PWM_I2C.SPI3_MOSI_M1
TX: H1.2 R67.2 U42.2
UART2_RX_M0_DEBUG: R68.1 ; port UART2.UART2_RX_M0_DEBUG
UART2_TX_M0_DEBUG: R67.1 ; port UART2.UART2_TX_M0_DEBUG
UART3_RX_M1: U39.1 ; port GPIO_UART_SPI_PWM_I2C.UART3_RX_M1
UART3_TX_M1: U39.2 ; port GPIO_UART_SPI_PWM_I2C.UART3_TX_M1
NetC233_2: C233.2 R104.2 SW2.1 SW2.2 U36.2
NetR103_2: R103.2 SW1.1 SW1.2 U35.2
NetR105_1: R105.1 R106.2 SW3.1 SW3.2 U37.2

### Library data of the parts
C233 = 100nF: as C70 on sheet POWER_PMIC
H1 = HX PZ2.54-1x4P ZZ: 4P 1x4P Gold Brass -40℃~+105℃ Black Pin Header 2.54mm 2.5mm 6mm 1kV 3mm 3A 1 Through Hole Through Hole,P=2.54mm Headers, Male Pins ROHS; Manufacturer: hanxia(韩下); Symbol: HX PZ2.54-1X3P ZZ; Add into BOM: yes; Pin Structure: 1x3P; Device: HX PZ2.54-1x3P ZZ; LCSC Part Name: 1x3P 间距:2.54mm 方针 直插; Supplier Part: C32713269; Manufacturer Part: HX PZ2.54-1x3P ZZ; Supplier Footprint: 插件,P=2.54mm; JLCPCB Part Class: Extended Part; Datasheet: https://item.szlcsc.com/datasheet/HX%2520PZ2.54-1x3P%2520ZZ/34444549.html; Supplier: LCSC; Convert to PCB: yes; Pitch: 2.54mm; Row Spacing: -; Circluar Pins/Square Pins: Pin Header; Mounting Type: Through Hole; Number of Rows: 1; Number of Pins: 3P; Current Rating: 3A; Voltage Rating (Max): 1kV; Length of Mating Pin: 6mm; Insulation Height: 2.5mm; Length of End Connection Pin: 3mm; Contact Material: Brass; Contact Plating: Gold; Operating Temperature: -40℃~+105℃; Color: Black; Supplementary Features: -
LED2 = E6C0606RGBC3UDA: RGB三色 SMD-4P,1.6x1.6mm; Symbol: E6C0606RGBC3UDA
R67 R68 R103-R105 = 100Ω: as R47 on sheet POWER_PMIC
R106 = 10kΩ: as R44 on sheet POWER_PMIC
SW1-SW3 = PTS815SJK250SMTRLFS: 4pin 轻触开关 SMD​; Symbol: PTS815SJK250SMTRLFS
U27 = ZX-XH2.54-2PLT: ;SMD,P=2.5mm;SMD,P=2.54mm; Symbol: ZX-XH2.54-2PLT
U35-U37 U42 U43 = ESD5451N_C5261080: 9A 9.8V 8V Bidirectional 5V DFN1006-2L TVS Diodes ROHS; Manufacturer: HXY MOSFET(华轩阳电子); Add into BOM: yes; Reverse Leakage Current (Ir): 500nA; Number of Channels: 1.0; level of protection: IEC 61000-4-2; Junction Capacitance: 15pF; Symbol: ESD5451N_C5261080; Device: ESD5451N_C5261080; LCSC Part Name: 5V 15pF 双向; Supplier Part: C5261080; Manufacturer Part: ESD5451N; Supplier Footprint: DFN1006-2L; JLCPCB Part Class: Extended Part; Datasheet: https://item.szlcsc.com/datasheet/ESD5451N/5983779.html; Supplier: LCSC; Convert to PCB: yes; Polarity: Bidirectional; Reverse Stand-Off Voltage (Vrwm): 5V; Clamping Voltage: 9.8V; Peak Pulse Current (Ipp): 9A; Voltage - Breakdown: 8V; Type: ESD
U38-U40 U44 = HX PZ2.54-1x6P ZZ: 6P 1x6P Gold Brass -40℃~+105℃ Black Pin Header 2.54mm 2.5mm 6mm 1kV 3mm 3A 1 Through Hole Through Hole,P=2.54mm Headers, Male Pins ROHS; Manufacturer: hanxia(韩下); Add into BOM: yes; Symbol: HX PZ2.54-1X6P ZZ; Device: HX PZ2.54-1x6P ZZ; LCSC Part Name: 1x6P 间距:2.54mm 方针 直插; Supplier Part: C32713272; Manufacturer Part: HX PZ2.54-1x6P ZZ; Supplier Footprint: 插件,P=2.54mm; JLCPCB Part Class: Extended Part; Datasheet: https://item.szlcsc.com/datasheet/HX%2520PZ2.54-1x6P%2520ZZ/34444552.html; Supplier: LCSC; Convert to PCB: yes; Pin Structure: 1x6P; Pitch: 2.54mm; Row Spacing: -; Circluar Pins/Square Pins: Pin Header; Mounting Type: Through Hole; Number of Rows: 1; Number of Pins: 6P; Current Rating: 3A; Voltage Rating (Max): 1kV; Length of Mating Pin: 6mm; Insulation Height: 2.5mm; Length of End Connection Pin: 3mm; Contact Material: Brass; Contact Plating: Gold; Operating Temperature: -40℃~+105℃; Color: Black; Supplementary Features: -

## Sheet USB_OTG_AND_HOST.SchDoc
size A3; SheetNumber: 2; SheetTotal: 20
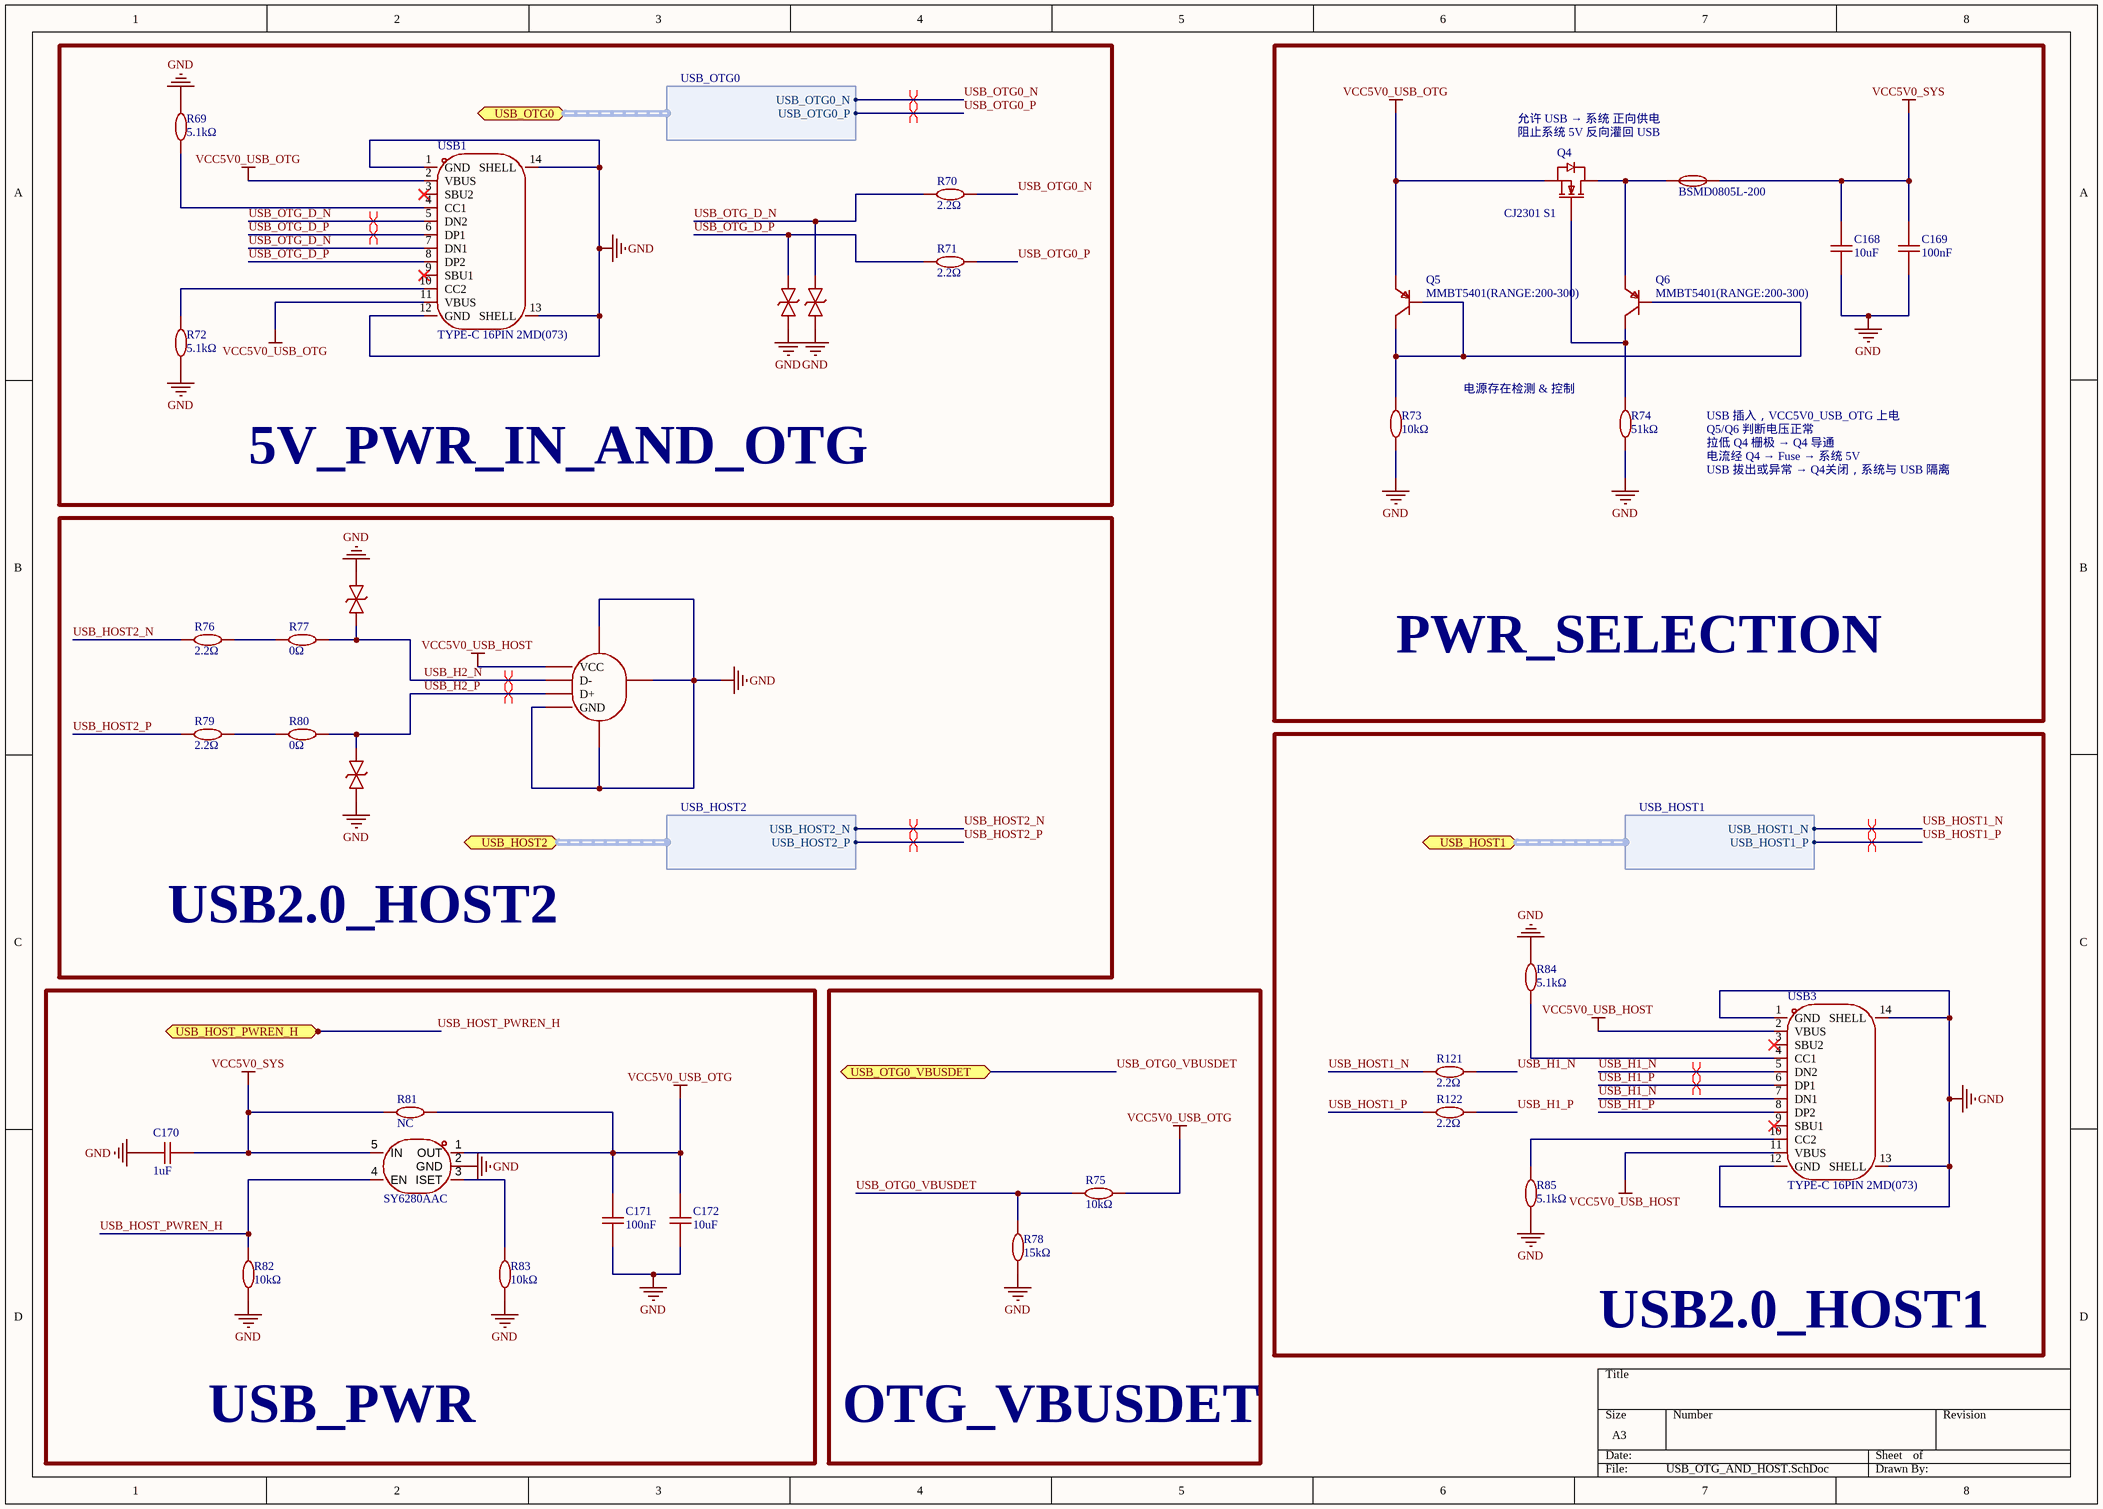
[diagram p19: USB_OTG_AND_HOST.SchDoc]

### Parts
C168  10uF  [C0603]
C169  100nF  [C0402]
C170  1uF  [C0402]
C171  100nF  [C0402]
C172  10uF  [C0603]
F1  BSMD0805L-200  [F0805]
Q4  CJ2301 S1  [SOT-23_L2.9-W1.3-P1.90-LS2.4-BR]
Q5  MMBT5401(RANGE:200-300)  [SOT-23_L2.9-W1.3-P1.90-LS2.4-BR]
Q6  MMBT5401(RANGE:200-300)  [SOT-23_L2.9-W1.3-P1.90-LS2.4-BR]
R69  5.1kΩ  [R0402]
R70  2.2Ω  [R0402]
R71  2.2Ω  [R0402]
R72  5.1kΩ  [R0402]
R73  10kΩ  [R0402]
R74  51kΩ  [R0402]
R75  10kΩ  [R0402]
R76  2.2Ω  [R0402]
R77  0Ω  [R0402]
R78  15kΩ  [R0402]
R79  2.2Ω  [R0402]
R80  0Ω  [R0402]
R81  NC  [R0402]
R82  10kΩ  [R0402]
R83  10kΩ  [R0402]
R84  5.1kΩ  [R0402]
R85  5.1kΩ  [R0402]
R121  2.2Ω  [R0402]
R122  2.2Ω  [R0402]
U29  ESD5451N  [DFN1006-2L-BI]  (value not drawn)
U30  ESD5451N  [DFN1006-2L-BI]  (value not drawn)
U31  ESD5451N  [DFN1006-2L-BI]  (value not drawn)
U32  ESD5451N  [DFN1006-2L-BI]  (value not drawn)
U33  SY6280AAC  [SOT-23-5_L3.0-W1.7-P0.95-LS2.8-BL]
USB1  TYPE-C 16PIN 2MD(073)  [USB-C-SMD_TYPE-C-6PIN-2MD-073]
USB2  AF 10.0 HC6.3  [USB-A-TH_AF-10.0-HC6.3]  (value not drawn)
USB3  TYPE-C 16PIN 2MD(073)  [USB-C-SMD_TYPE-C-6PIN-2MD-073]

### Blocks framed on the sheet
5V_PWR_IN_AND_OTG: R69-R72 U29 U30 USB1
PWR_SELECTION: C168 C169 F1 Q4-Q6 R73 R74
USB2.0_HOST2: R76 R77 R79 R80 U31 U32 USB2
USB2.0_HOST1: R84 R85 R121 R122 USB3
USB_PWR: C170-C172 R81-R83 U33
OTG_VBUSDET: R75 R78

### Ports
USB_HOST1 (bidir, harness USB_HOST1, see Overview[2B], RK3566[3C], RK3566_USB_GPIO[1B]), USB_HOST2 (bidir, harness USB_HOST2, see Overview[2C], RK3566[3C], RK3566_USB_GPIO[1A]), USB_HOST_PWREN_H (bidir, see Overview[2C], RK3566[3C], RK3566_USB_GPIO[1B]), USB_OTG0 (bidir, harness USB_OTG0, see Overview[2B], RK3566[3C], RK3566_USB_GPIO[1A]), USB_OTG0_VBUSDET (bidir, see Overview[2C], RK3566[3C], RK3566_USB_GPIO[1B])

### Harnesses
USB_OTG0: USB_OTG0_N, USB_OTG0_P
USB_HOST2: USB_HOST2_N, USB_HOST2_P
USB_HOST1: USB_HOST1_N, USB_HOST1_P

### Nets
GND: C168.1 C169.1 C170.1 C171.1 C172.1 R69.2 R72.1 R73.1 R74.1 R78.1 R82.1 R83.1 R84.2 R85.1 U29.1 U30.1 U31.2 U32.1 U33.2(GND) USB1.1(GND) USB1.12(GND) USB1.13(SHELL) USB1.14(SHELL) USB2.4(GND) USB2.5 USB2.6 USB2.7 USB3.1(GND) USB3.12(GND) USB3.13(SHELL) USB3.14(SHELL)
VCC5V0_SYS: C168.2 C169.2 C170.2 F1.2 R81.1 U33.5(IN)
VCC5V0_USB_HOST: USB2.1(VCC) USB3.2(VBUS) USB3.11(VBUS)
VCC5V0_USB_OTG: C171.2 C172.2 Q4.2(S) Q5.2(E) R75.2 R81.2 U33.1(OUT) USB1.2(VBUS) USB1.11(VBUS)
USB_H1_N: R121.2 USB3.5(DN2) USB3.7(DN1)
USB_H1_P: R122.2 USB3.6(DP1) USB3.8(DP2)
USB_H2_N: R77.2 U31.1 USB2.2(D-)
USB_H2_P: R80.2 U32.2 USB2.3(D+)
USB_HOST1_N: R121.1 ; port USB_HOST1.USB_HOST1_N
USB_HOST1_P: R122.1 ; port USB_HOST1.USB_HOST1_P
USB_HOST2_N: R76.1 ; port USB_HOST2.USB_HOST2_N
USB_HOST2_P: R79.1 ; port USB_HOST2.USB_HOST2_P
USB_HOST_PWREN_H: R82.2 U33.4(EN) ; port USB_HOST_PWREN_H
USB_OTG0_N: R70.2 ; port USB_OTG0.USB_OTG0_N
USB_OTG0_P: R71.2 ; port USB_OTG0.USB_OTG0_P
USB_OTG0_VBUSDET: R75.1 R78.2 ; port USB_OTG0_VBUSDET
USB_OTG_D_N: R70.1 U30.2 USB1.5(DN2) USB1.7(DN1)
USB_OTG_D_P: R71.1 U29.2 USB1.6(DP1) USB1.8(DP2)
NetF1_1: F1.1 Q4.3(D) Q6.2(E)
NetQ4_1: Q4.1(G) Q6.3(B) R74.2
NetQ5_1: Q5.1(B) Q5.3(B) Q6.1(B) R73.2
NetR69_1: R69.1 USB1.4(CC1)
NetR72_2: R72.2 USB1.10(CC2)
NetR76_2: R76.2 R77.1
NetR79_2: R79.2 R80.1
NetR83_2: R83.2 U33.3(ISET)
NetR84_1: R84.1 USB3.4(CC1)
NetR85_2: R85.2 USB3.10(CC2)

Not connected (* = marked no-connect by the designer): USB1 3(SBU2)* 9(SBU1)*; USB3 3(SBU2)* 9(SBU1)*

### Layout directives
differential pair: USB_H1_N, USB_H1_P, USB_H2_N, USB_H2_P, USB_HOST1_N, USB_HOST1_P, USB_HOST2_N, USB_HOST2_P, USB_OTG0_N, USB_OTG0_P, USB_OTG_D_N, USB_OTG_D_P

### Notes on the sheet
- 允许 USB → 系统 正向供电
- (near Q4) 阻止系统 5V 反向灌回 USB
- 电源存在检测 & 控制
- USB 插入，VCC5V0_USB_OTG 上电
- Q5/Q6 判断电压正常
- 拉低 Q4 栅极 → Q4 导通
- 电流经 Q4 → Fuse → 系统 5V
- USB 拔出或异常 → Q4关闭，系统与 USB 隔离

### Library data of the parts
C168 C172 = 10uF: as C77 on sheet POWER_PMIC
C169 C171 = 100nF: as C70 on sheet POWER_PMIC
C170 = 1uF: as C71 on sheet POWER_PMIC
F1 = BSMD0805L-200: 6V 2A 0805自恢复; Symbol: BSMD0805L-200
Q4 = CJ2301 S1: 1个P沟道 耐压:20V 电流:2.3A ,-20V,-2.3A,112mΩ@-4.5V
Q5 Q6 = MMBT5401(RANGE:200-300): PNP hfe=200~300 PNP 电流:0.6A 电压:150V
R69 R72 R84 R85 = 5.1kΩ: 5.1kΩ 62.5mW 50V ±100ppm/℃ Thick Film Resistor ±1% 0402 Chip Resistor - Surface Mount ROHS
R70 R71 R76 R79 R121 R122 = 2.2Ω: 小尺寸、重量轻。降低组装成本,与贴片机匹配。适用于波峰焊和回流焊
R73 R75 R82 R83 = 10kΩ: as R44 on sheet POWER_PMIC
R74 = 51kΩ: as R57 on sheet POWER_EXTENSION
R77 R80 = 0Ω: as R45 on sheet POWER_PMIC
R78 = 15kΩ: 62.5mW 15kΩ 50V ±100ppm/℃ Thick Film Resistor ±1% 0402 Chip Resistor - Surface Mount ROHS
R81 = 10Ω: 10Ω 62.5mW 50V ±200ppm/℃ Thick Film Resistor ±1% 0402 Chip Resistor - Surface Mount ROHS
U29-U32 = ESD5451N_C5261080: as U35-U37 on sheet DEBUG_AND_GPIO; Symbol: ESD5451N_C5261080; Device: ESD5451N_C5261080; LCSC Part Name: 5V 15pF 双向; Supplier Part: C5261080; Manufacturer Part: ESD5451N; Supplier Footprint: DFN1006-2L; JLCPCB Part Class: Extended Part; Datasheet: https://item.szlcsc.com/datasheet/ESD5451N/5983779.html; Supplier: LCSC; Convert to PCB: yes; Polarity: Bidirectional; Reverse Stand-Off Voltage (Vrwm): 5V; Clamping Voltage: 9.8V; Peak Pulse Current (Ipp): 9A; Voltage - Breakdown: 8V; Type: ESD
U33 = SY6280AAC: 低损耗功率分配开关; Symbol: SY6280AAC
USB1 USB3 = TYPE-C 16PIN 2MD(073): 16pin type-c
USB2 = AF 10.0 HC6.3: Type-A 母 弯插; Manufacturer: 精拓金; Symbol: AFSide of the three straight feet boundless copper14.0PBTWhite plastic90degree; Device: 906-162A1011D10200; Add into BOM: yes; Protocol Standard: USB 2.0; Gender: Female; Number of Contacts: 4P; Number of Ports: 1; Current Rating-Power: 2A; LCSC Part Name: Type-A 母 侧插; Supplier Part: C39417; Manufacturer Part: 906-162A1011D10200; Supplier Footprint: 插件; JLCPCB Part Class: Extended Part; Datasheet: https://item.szlcsc.com/datasheet/906-162A1011D10200/40400.html; Supplier: LCSC; Convert to PCB: yes; Connector Type: Type-A; Mounting Type: Vertical, Flag; Operating Temperature: -

## Nets that join several sheets
GND: RK3566_DDR_PHY (11 pins), RK3566_FLASH_SD_SARADC (6 pins), RK3566_USB_GPIO (22 pins), RK3566_MIPI_HDMI (14 pins), RK3566_OSC_PLL_PMUO1_2 (20 pins), RK3566_POWER (207 pins), LPDDR4 (109 pins), EMMC_SD (36 pins), Wi-Fi_BT (23 pins), HDMI (19 pins), MIPI_DSI_TP (25 pins), POWER (25 pins), POWER_PMIC (54 pins), POWER_EXTENSION (14 pins), POWER_FLASH_POWER_MANAGE (C174.1 R89.1), Audio_AND_HPJ (14 pins), DEBUG_AND_GPIO (22 pins), USB_OTG_AND_HOST (31 pins)
VCC3V3_PMU: RK3566_OSC_PLL_PMUO1_2 (10 pins), POWER_PMIC (C110.1 R46.2 U20.31), POWER_EXTENSION (R57.2), POWER_FLASH_POWER_MANAGE (R87.2)
VCC3V3_SD: EMMC_SD (C190.2 C191.2 U7.4), POWER_PMIC (C82.2 U20.58)
VCC3V3_SYS: Wi-Fi_BT (C46.2 C47.2 U12.9), POWER (6 pins), POWER_PMIC (18 pins), Audio_AND_HPJ (R95.2), DEBUG_AND_GPIO (LED2.2 U40.5 U40.6)
VCC5V0_SYS: HDMI (D7.2 Q1.1), MIPI_DSI_TP (C56.2 U13.1 U14.6), POWER (9 pins), POWER_PMIC (L10.1 R52.2), POWER_EXTENSION (6 pins), DEBUG_AND_GPIO (H1.1 U27.2 U40.4), USB_OTG_AND_HOST (6 pins)
VCC_1V8: RK3566_USB_GPIO (R107.1), POWER_PMIC (C92.2 C93.2 L6.2 R49.1), POWER_EXTENSION (R59.1), POWER_FLASH_POWER_MANAGE (R86.1)
VCC_3V3: RK3566_USB_GPIO (7 pins), EMMC_SD (7 pins), HDMI (5 pins), MIPI_DSI_TP (8 pins), POWER_PMIC (C85.2 U20.55), POWER_EXTENSION (R60.1), POWER_FLASH_POWER_MANAGE (R88.1)
VCC_DDR: RK3566_DDR_PHY (24 pins), LPDDR4 (88 pins), POWER_PMIC (5 pins)
VCCA1V8_IMAGE: RK3566_USB_GPIO (C207.2 C208.2 U2.1G17), RK3566_MIPI_HDMI (8 pins), POWER_PMIC (C75.1 U20.6)
VCCA1V8_PMU: RK3566_OSC_PLL_PMUO1_2 (C224.2 C225.2 U2.1N18), LPDDR4 (R63.2), POWER_PMIC (C74.1 U20.5)
VCCA_1V8: RK3566_USB_GPIO (10 pins), RK3566_OSC_PLL_PMUO1_2 (C228.2 C229.2 U2.1H4), POWER_PMIC (C71.1 U20.3), DEBUG_AND_GPIO (R106.1)
VCCIO_ACODEC: RK3566_FLASH_SD_SARADC (C193.2 U2.1D13), POWER_PMIC (C102.1 U20.28), Audio_AND_HPJ (R123.1)
VCCIO_FLASH: RK3566_FLASH_SD_SARADC (C195.2 U2.1C13), EMMC_SD (13 pins), POWER_FLASH_POWER_MANAGE (C174.2 R86.2 R88.2)
VCCIO_SD: RK3566_FLASH_SD_SARADC (C194.2 U2.1F17), POWER_PMIC (C108.1 U20.29)
VCCIO_WL: RK3566_FLASH_SD_SARADC (C192.2 U2.1E16), Wi-Fi_BT (C49.2 C50.2 U12.22), POWER_PMIC (R44.2), POWER_EXTENSION (C125.2 R59.2 R60.2)
VDD_CPU: RK3566_POWER (18 pins), POWER_EXTENSION (9 pins)
VDD_GPU: RK3566_POWER (10 pins), POWER_PMIC (8 pins)
VDD_LOGIC: RK3566_POWER (16 pins), POWER_PMIC (8 pins)
VDD_NPU: RK3566_POWER (9 pins), POWER_PMIC (8 pins)
VDDA0V9_IMAGE: RK3566_USB_GPIO (C203.2 C206.2 U2.1H17), RK3566_MIPI_HDMI (9 pins), POWER_PMIC (C97.1 U20.23)
VDDA0V9_PMU: RK3566_OSC_PLL_PMUO1_2 (6 pins), POWER_PMIC (C90.1 U20.20)
VDDA_0V9: RK3566_USB_GPIO (7 pins), RK3566_OSC_PLL_PMUO1_2 (C226.2 C227.2 U2.1H5), POWER_PMIC (C94.1 U20.21)
BT_REG_ON_H: RK3566_FLASH_SD_SARADC (U2.D38), Wi-Fi_BT (U12.34)
BT_WAKE_HOST_H: RK3566_FLASH_SD_SARADC (U2.A37), Wi-Fi_BT (U12.7)
CLK1_M0_GPIO1_A4: RK3566_FLASH_SD_SARADC (U2.1A13), DEBUG_AND_GPIO (U40.1)
EMMC_CLKOUT/FLASH_DQS: RK3566_FLASH_SD_SARADC (R9.1), EMMC_SD (U3.M6)
EMMC_CMD: RK3566_FLASH_SD_SARADC (U2.A27), EMMC_SD (R64.1 U3.M5)
EMMC_D0/FLASH_D0: RK3566_FLASH_SD_SARADC (SW4.1 SW4.2 U2.A32), EMMC_SD (R114.2 U3.A3)
EMMC_D1/FLASH_D1: RK3566_FLASH_SD_SARADC (U2.B27), EMMC_SD (U3.A4)
EMMC_D2/FLASH_D2: RK3566_FLASH_SD_SARADC (U2.B32), EMMC_SD (U3.A5)
EMMC_D3/FLASH_D3: RK3566_FLASH_SD_SARADC (U2.B29), EMMC_SD (U3.A2 U3.B2)
EMMC_D4/FLASH_D4: RK3566_FLASH_SD_SARADC (U2.B33), EMMC_SD (U3.B3)
EMMC_D5/FLASH_D5: RK3566_FLASH_SD_SARADC (U2.A30), EMMC_SD (U3.B4 U3.C5)
EMMC_D6/FLASH_D6: RK3566_FLASH_SD_SARADC (U2.B30), EMMC_SD (U3.B5)
EMMC_D7/FLASH_D7: RK3566_FLASH_SD_SARADC (U2.A33), EMMC_SD (U3.A7 U3.B6)
EMMC_DATA_STROBE: RK3566_FLASH_SD_SARADC (R7.2), EMMC_SD (R66.1 U3.H5)
EMMC_RSTN: RK3566_FLASH_SD_SARADC (U2.1B16), EMMC_SD (C159.2 R65.1 U3.K5)
FLASH_VOL_SEL: RK3566_OSC_PLL_PMUO1_2 (U2.AF38), POWER_FLASH_POWER_MANAGE (R87.1 R89.2)
GPIO3_A2: RK3566_USB_GPIO (U2.AR10), DEBUG_AND_GPIO (U38.2)
GPIO3_A3: RK3566_USB_GPIO (U2.AP10), DEBUG_AND_GPIO (U38.1)
HDMI_TX0_N: RK3566_MIPI_HDMI (R27.1), HDMI (CN1.9 D2.4 D2.7)
HDMI_TX0_P: RK3566_MIPI_HDMI (R26.1), HDMI (CN1.7 D2.5 D2.6)
HDMI_TX1_N: RK3566_MIPI_HDMI (R25.1), HDMI (CN1.6 D1.1 D1.10)
HDMI_TX1_P: RK3566_MIPI_HDMI (R24.1), HDMI (CN1.4 D1.2 D1.9)
HDMI_TX2_N: RK3566_MIPI_HDMI (R23.1), HDMI (CN1.3 D1.4 D1.7)
HDMI_TX2_P: RK3566_MIPI_HDMI (R22.1), HDMI (CN1.1 D1.5 D1.6)
HDMI_TX_HPDIN: RK3566_MIPI_HDMI (C54.2 U2.1V17), HDMI (R15.2)
HDMI_TXC_N: RK3566_MIPI_HDMI (R29.1), HDMI (CN1.12 D2.1 D2.10)
HDMI_TXC_P: RK3566_MIPI_HDMI (R28.1), HDMI (CN1.10 D2.2 D2.9)
HDMITX_CEC_M0: RK3566_USB_GPIO (U2.1V5), HDMI (Q1.2 R16.2 R17.1)
HDMITX_SCL: RK3566_USB_GPIO (U2.AR12), HDMI (Q2.2 R19.1)
HDMITX_SDA: RK3566_USB_GPIO (U2.AP11), HDMI (Q3.2 R21.1)
HOST_WAKE_BT_H: RK3566_FLASH_SD_SARADC (U2.B36), Wi-Fi_BT (U12.6)
HP_PLUG_IN_DET: RK3566_OSC_PLL_PMUO1_2 (U2.1U19), Audio_AND_HPJ (C179.2 R95.1 R96.1)
HP_SNS: POWER_PMIC (C113.2 U20.40), Audio_AND_HPJ (AUDIO1.2 R94.1)
HPL_OUT: POWER_PMIC (U20.39), Audio_AND_HPJ (AUDIO1.4)
HPR_OUT: POWER_PMIC (U20.41), Audio_AND_HPJ (AUDIO1.3)
I2C0_SCL_PMIC: RK3566_OSC_PLL_PMUO1_2 (R101.1 U2.AJ37), POWER_PMIC (U20.1), POWER_EXTENSION (*1.A3)
I2C0_SDA_PMIC: RK3566_OSC_PLL_PMUO1_2 (R100.1 U2.AK38), POWER_PMIC (U20.2), POWER_EXTENSION (*1.B1)
I2C1_SCL_TP: RK3566_OSC_PLL_PMUO1_2 (R35.1 U2.AK37), MIPI_DSI_TP (FPC2.6 U18.2)
I2C1_SDA_TP: RK3566_OSC_PLL_PMUO1_2 (R34.1 U2.AM38), MIPI_DSI_TP (FPC2.5 U17.2)
I2C2_SCL_M0: RK3566_OSC_PLL_PMUO1_2 (R99.1 U2.1U20), DEBUG_AND_GPIO (U40.3)
I2C2_SDA_M0: RK3566_OSC_PLL_PMUO1_2 (R98.1 U2.1R16), DEBUG_AND_GPIO (U40.2)
I2C3_SCL_M1: RK3566_USB_GPIO (U2.1T4), DEBUG_AND_GPIO (U38.3)
I2C3_SDA_M1: RK3566_USB_GPIO (U2.1V2), DEBUG_AND_GPIO (U38.4)
I2S1_LRCK_TX_M0_PMIC: RK3566_FLASH_SD_SARADC (U2.B24), POWER_PMIC (U20.14)
I2S1_MCLK_M0_PMIC: RK3566_FLASH_SD_SARADC (U2.A23), POWER_PMIC (U20.16)
I2S1_SCLK_TX_M0_PMIC: RK3566_FLASH_SD_SARADC (U2.B23), POWER_PMIC (U20.15)
I2S1_SDI0_M0/PDM: RK3566_FLASH_SD_SARADC (U2.1B14), POWER_PMIC (U20.18)
I2S1_SDO0_MO_PMIC: RK3566_FLASH_SD_SARADC (U2.B25), POWER_PMIC (U20.17)
I2S2_LRCK_TX_M0: RK3566_FLASH_SD_SARADC (U2.1D19), Wi-Fi_BT (U12.28)
I2S2_SCLK_TX_M0: RK3566_FLASH_SD_SARADC (U2.C37), Wi-Fi_BT (U12.26)
I2S2_SDI_M0: RK3566_FLASH_SD_SARADC (U2.D37), Wi-Fi_BT (R13.1 U12.25)
I2S2_SDO_M0: RK3566_FLASH_SD_SARADC (U2.1B20), Wi-Fi_BT (U12.27)
LPDDR4_A0_A: RK3566_DDR_PHY (U2.C2), LPDDR4 (U1.H2)
LPDDR4_A0_B: RK3566_DDR_PHY (U2.A9), LPDDR4 (U1.R2)
LPDDR4_A1_A: RK3566_DDR_PHY (U2.C1), LPDDR4 (U1.J2)
LPDDR4_A1_B: RK3566_DDR_PHY (U2.B9), LPDDR4 (U1.P2)
LPDDR4_A2_A: RK3566_DDR_PHY (U2.1C1), LPDDR4 (U1.H9)
LPDDR4_A2_B: RK3566_DDR_PHY (U2.1B7), LPDDR4 (U1.R9)
LPDDR4_A3_A: RK3566_DDR_PHY (U2.1B3), LPDDR4 (U1.H10)
LPDDR4_A3_B: RK3566_DDR_PHY (U2.1B6), LPDDR4 (U1.R10)
LPDDR4_A4_A: RK3566_DDR_PHY (U2.1B1), LPDDR4 (U1.H11)
LPDDR4_A4_B: RK3566_DDR_PHY (U2.1A6), LPDDR4 (U1.R11)
LPDDR4_A5_A: RK3566_DDR_PHY (U2.1A1), LPDDR4 (U1.J11)
LPDDR4_A5_B: RK3566_DDR_PHY (U2.B8), LPDDR4 (U1.P11)
LPDDR4_CKE0_A: RK3566_DDR_PHY (U2.B4), LPDDR4 (U1.J4)
LPDDR4_CKE0_B: RK3566_DDR_PHY (U2.1A3), LPDDR4 (U1.P4)
LPDDR4_CKE1_A: RK3566_DDR_PHY (U2.1C3), LPDDR4 (U1.J5)
LPDDR4_CKE1_B: RK3566_DDR_PHY (U2.1A2), LPDDR4 (U1.P5)
LPDDR4_CLK_A_N: RK3566_DDR_PHY (U2.B5), LPDDR4 (U1.J9)
LPDDR4_CLK_A_P: RK3566_DDR_PHY (U2.A5), LPDDR4 (U1.J8)
LPDDR4_CLK_B_N: RK3566_DDR_PHY (U2.B7), LPDDR4 (U1.P9)
LPDDR4_CLK_B_P: RK3566_DDR_PHY (U2.A7), LPDDR4 (U1.P8)
LPDDR4_CS0n_A: RK3566_DDR_PHY (U2.B3), LPDDR4 (U1.H4)
LPDDR4_CS0n_B: RK3566_DDR_PHY (U2.1B5), LPDDR4 (U1.R4)
LPDDR4_CS1n_A: RK3566_DDR_PHY (U2.A3), LPDDR4 (U1.H3)
LPDDR4_CS1n_B: RK3566_DDR_PHY (U2.1A5), LPDDR4 (U1.R3)
LPDDR4_DM0_A: RK3566_DDR_PHY (U2.1E2), LPDDR4 (U1.C3)
LPDDR4_DM0_B: RK3566_DDR_PHY (U2.1B8), LPDDR4 (U1.Y3)
LPDDR4_DM1_A: RK3566_DDR_PHY (U2.1G1), LPDDR4 (U1.C10)
LPDDR4_DM1_B: RK3566_DDR_PHY (U2.1A11), LPDDR4 (U1.Y10)
LPDDR4_DQ0_A: RK3566_DDR_PHY (U2.G2), LPDDR4 (U1.B2)
LPDDR4_DQ0_B: RK3566_DDR_PHY (U2.B12), LPDDR4 (U1.AA2)
LPDDR4_DQ1_A: RK3566_DDR_PHY (U2.F2), LPDDR4 (U1.C2)
LPDDR4_DQ1_B: RK3566_DDR_PHY (U2.B10), LPDDR4 (U1.Y2)
LPDDR4_DQ2_A: RK3566_DDR_PHY (U2.F1), LPDDR4 (U1.E2)
LPDDR4_DQ2_B: RK3566_DDR_PHY (U2.1A8), LPDDR4 (U1.V2)
LPDDR4_DQ3_A: RK3566_DDR_PHY (U2.E1), LPDDR4 (U1.F2)
LPDDR4_DQ3_B: RK3566_DDR_PHY (U2.1A7), LPDDR4 (U1.U2)
LPDDR4_DQ4_A: RK3566_DDR_PHY (U2.M2), LPDDR4 (U1.F4)
LPDDR4_DQ4_B: RK3566_DDR_PHY (U2.B13), LPDDR4 (U1.U4)
LPDDR4_DQ5_A: RK3566_DDR_PHY (U2.K1), LPDDR4 (U1.E4)
LPDDR4_DQ5_B: RK3566_DDR_PHY (U2.1A10), LPDDR4 (U1.V4)
LPDDR4_DQ6_A: RK3566_DDR_PHY (U2.K2), LPDDR4 (U1.C4)
LPDDR4_DQ6_B: RK3566_DDR_PHY (U2.1B9), LPDDR4 (U1.Y4)
LPDDR4_DQ7_A: RK3566_DDR_PHY (U2.1E1), LPDDR4 (U1.B4)
LPDDR4_DQ7_B: RK3566_DDR_PHY (U2.1A9), LPDDR4 (U1.AA4)
LPDDR4_DQ8_A: RK3566_DDR_PHY (U2.P2), LPDDR4 (U1.B11)
LPDDR4_DQ8_B: RK3566_DDR_PHY (U2.B19), LPDDR4 (U1.AA11)
LPDDR4_DQ9_A: RK3566_DDR_PHY (U2.R1), LPDDR4 (U1.C11)
LPDDR4_DQ9_B: RK3566_DDR_PHY (U2.A19), LPDDR4 (U1.Y11)
LPDDR4_DQ10_A: RK3566_DDR_PHY (U2.R2), LPDDR4 (U1.E11)
LPDDR4_DQ10_B: RK3566_DDR_PHY (U2.A20), LPDDR4 (U1.V11)
LPDDR4_DQ11_A: RK3566_DDR_PHY (U2.T2), LPDDR4 (U1.F11)
LPDDR4_DQ11_B: RK3566_DDR_PHY (U2.B20), LPDDR4 (U1.U11)
LPDDR4_DQ12_A: RK3566_DDR_PHY (U2.M1), LPDDR4 (U1.F9)
LPDDR4_DQ12_B: RK3566_DDR_PHY (U2.A15), LPDDR4 (U1.U9)
LPDDR4_DQ13_A: RK3566_DDR_PHY (U2.1F2), LPDDR4 (U1.E9)
LPDDR4_DQ13_B: RK3566_DDR_PHY (U2.B15), LPDDR4 (U1.V9)
LPDDR4_DQ14_A: RK3566_DDR_PHY (U2.1F1), LPDDR4 (U1.C9)
LPDDR4_DQ14_B: RK3566_DDR_PHY (U2.1C10), LPDDR4 (U1.Y9)
LPDDR4_DQ15_A: RK3566_DDR_PHY (U2.1G2), LPDDR4 (U1.B9)
LPDDR4_DQ15_B: RK3566_DDR_PHY (U2.B16), LPDDR4 (U1.AA9)
LPDDR4_DQS0_A_N: RK3566_DDR_PHY (U2.H1), LPDDR4 (U1.E3)
LPDDR4_DQS0_A_P: RK3566_DDR_PHY (U2.H2), LPDDR4 (U1.D3)
LPDDR4_DQS0_B_N: RK3566_DDR_PHY (U2.A12), LPDDR4 (U1.V3)
LPDDR4_DQS0_B_P: RK3566_DDR_PHY (U2.A13), LPDDR4 (U1.W3)
LPDDR4_DQS1_A_N: RK3566_DDR_PHY (U2.N2), LPDDR4 (U1.E10)
LPDDR4_DQS1_A_P: RK3566_DDR_PHY (U2.N1), LPDDR4 (U1.D10)
LPDDR4_DQS1_B_N: RK3566_DDR_PHY (U2.B17), LPDDR4 (U1.V10)
LPDDR4_DQS1_B_P: RK3566_DDR_PHY (U2.A17), LPDDR4 (U1.W10)
LPDDR4_ODT0_CA_A: RK3566_DDR_PHY (U2.E2), LPDDR4 (U1.G2)
LPDDR4_ODT0_CA_B: RK3566_DDR_PHY (U2.A10), LPDDR4 (U1.T2)
LPDDR4_RESETN: RK3566_DDR_PHY (U2.1C7), LPDDR4 (C149.2 U1.T11)
MIC1P: POWER_PMIC (C116.2), Audio_AND_HPJ (5 pins)
MIPI_DSI_0_N: RK3566_MIPI_HDMI (U2.AR24), MIPI_DSI_TP (FPC1.21)
MIPI_DSI_0_P: RK3566_MIPI_HDMI (U2.AP24), MIPI_DSI_TP (FPC1.20)
MIPI_DSI_1_N: RK3566_MIPI_HDMI (U2.AP23), MIPI_DSI_TP (FPC1.15)
MIPI_DSI_1_P: RK3566_MIPI_HDMI (U2.AR23), MIPI_DSI_TP (FPC1.14)
MIPI_DSI_2_N: RK3566_MIPI_HDMI (U2.AR21), MIPI_DSI_TP (FPC1.12)
MIPI_DSI_2_P: RK3566_MIPI_HDMI (U2.AP21), MIPI_DSI_TP (FPC1.11)
MIPI_DSI_3_N: RK3566_MIPI_HDMI (U2.AP20), MIPI_DSI_TP (FPC1.24)
MIPI_DSI_3_P: RK3566_MIPI_HDMI (U2.AR20), MIPI_DSI_TP (FPC1.23)
MIPI_DSI_CLK_N: RK3566_MIPI_HDMI (U2.1U11), MIPI_DSI_TP (FPC1.18)
MIPI_DSI_CLK_P: RK3566_MIPI_HDMI (U2.1V11), MIPI_DSI_TP (FPC1.17)
MIPI_DSI_RESET: RK3566_USB_GPIO (U2.AP4), MIPI_DSI_TP (FPC1.27)
PDM_CLK0_M0_PMIC: RK3566_FLASH_SD_SARADC (U2.1A14), POWER_PMIC (U20.19)
PMIC_32KOUT_WIFI: Wi-Fi_BT (U12.24), POWER_PMIC (R44.1 R45.2)
PMIC_INT_L: RK3566_OSC_PLL_PMUO1_2 (U2.1R19), POWER_PMIC (U20.7)
PMIC_SLEEP_H: RK3566_OSC_PLL_PMUO1_2 (U2.1P19), POWER_PMIC (U20.49), POWER_EXTENSION (R58.1)
PWM5_LCD_BL: RK3566_OSC_PLL_PMUO1_2 (U2.AN37), MIPI_DSI_TP (R33.2 U14.4)
PWM14_M0: RK3566_USB_GPIO (U2.1P3), DEBUG_AND_GPIO (U38.5)
PWM15_IR_M0: RK3566_USB_GPIO (U2.1P4), DEBUG_AND_GPIO (U38.6)
PWRON_KEY: POWER_PMIC (C91.1 U20.52), DEBUG_AND_GPIO (R104.1)
RESETN: RK3566_OSC_PLL_PMUO1_2 (C231.2 R102.2 U2.AG38), POWER_PMIC (C70.1 R46.1 U20.67), DEBUG_AND_GPIO (R103.1)
RGB_LED_B: RK3566_FLASH_SD_SARADC (U2.1B13), DEBUG_AND_GPIO (LED2.1)
RGB_LED_G: RK3566_FLASH_SD_SARADC (U2.A26), DEBUG_AND_GPIO (LED2.3)
RGB_LED_R: RK3566_FLASH_SD_SARADC (U2.B26), DEBUG_AND_GPIO (LED2.4)
SARADC_VIN0: RK3566_USB_GPIO (C236.1 U2.1D17), DEBUG_AND_GPIO (R105.2)
SDMMC0_CLK: RK3566_FLASH_SD_SARADC (R10.2), EMMC_SD (U7.5 U8.2)
SDMMC0_CMD: RK3566_FLASH_SD_SARADC (U2.1E19), EMMC_SD (R5.1)
SDMMC0_D0: RK3566_FLASH_SD_SARADC (U2.1E20), EMMC_SD (R1.1)
SDMMC0_D1: RK3566_FLASH_SD_SARADC (U2.1F19), EMMC_SD (R2.1)
SDMMC0_D2: RK3566_FLASH_SD_SARADC (U2.1D20), EMMC_SD (R3.1)
SDMMC0_D3: RK3566_FLASH_SD_SARADC (U2.1F18), EMMC_SD (R4.1)
SDMMC0_DET_L: RK3566_OSC_PLL_PMUO1_2 (U2.AF37), EMMC_SD (R6.1)
SDMMC1_CLK: RK3566_FLASH_SD_SARADC (R8.2), Wi-Fi_BT (U12.17)
SDMMC1_CMD: RK3566_FLASH_SD_SARADC (U2.B35), Wi-Fi_BT (U12.16)
SDMMC1_D0: RK3566_FLASH_SD_SARADC (U2.1C19), Wi-Fi_BT (U12.18)
SDMMC1_D1: RK3566_FLASH_SD_SARADC (U2.1E18), Wi-Fi_BT (U12.19)
SDMMC1_D2: RK3566_FLASH_SD_SARADC (U2.1D18), Wi-Fi_BT (U12.14)
SDMMC1_D3: RK3566_FLASH_SD_SARADC (U2.1A20), Wi-Fi_BT (U12.15)
SPI3_CLK_M1: RK3566_USB_GPIO (U2.1U7), DEBUG_AND_GPIO (U39.6)
SPI3_CS0_M1: RK3566_USB_GPIO (U2.1T6), DEBUG_AND_GPIO (U39.3)
SPI3_MISO_M1: RK3566_USB_GPIO (U2.1U6), DEBUG_AND_GPIO (U39.4)
SPI3_MOSI_M1: RK3566_USB_GPIO (U2.AP12), DEBUG_AND_GPIO (U39.5)
SPK_OUTN: POWER_PMIC (C115.2 L9.1), Audio_AND_HPJ (CN3.1 U24.2)
SPK_OUTP: POWER_PMIC (C114.2 L8.1), Audio_AND_HPJ (CN3.2 U23.2)
TP_INT_A: RK3566_FLASH_SD_SARADC (U2.A22), MIPI_DSI_TP (FPC2.4 U16.2)
TP_RST: RK3566_FLASH_SD_SARADC (U2.B22), MIPI_DSI_TP (FPC2.1 U15.2)
UART1_CTSN_M0: RK3566_FLASH_SD_SARADC (U2.G37), Wi-Fi_BT (R11.1 U12.41)
UART1_RTSN_M0: RK3566_FLASH_SD_SARADC (U2.F37), Wi-Fi_BT (U12.44)
UART1_RX_M0: RK3566_FLASH_SD_SARADC (U2.1C20), Wi-Fi_BT (U12.42)
UART1_TX_M0: RK3566_FLASH_SD_SARADC (U2.F38), Wi-Fi_BT (U12.43)
UART2_RX_M0_DEBUG: RK3566_OSC_PLL_PMUO1_2 (U2.1V19), DEBUG_AND_GPIO (R68.1)
UART2_TX_M0_DEBUG: RK3566_OSC_PLL_PMUO1_2 (U2.1U18), DEBUG_AND_GPIO (R67.1)
UART3_RX_M1: RK3566_USB_GPIO (U2.AR4), DEBUG_AND_GPIO (U39.1)
UART3_TX_M1: RK3566_USB_GPIO (U2.AP5), DEBUG_AND_GPIO (U39.2)
USB_HOST1_N: RK3566_USB_GPIO (U2.1J20), USB_OTG_AND_HOST (R121.1)
USB_HOST1_P: RK3566_USB_GPIO (U2.1J19), USB_OTG_AND_HOST (R122.1)
USB_HOST2_N: RK3566_USB_GPIO (U2.V1), USB_OTG_AND_HOST (R76.1)
USB_HOST2_P: RK3566_USB_GPIO (U2.V2), USB_OTG_AND_HOST (R79.1)
USB_HOST_PWREN_H: RK3566_USB_GPIO (U2.1V6), USB_OTG_AND_HOST (R82.2 U33.4)
USB_OTG0_N: RK3566_USB_GPIO (U2.R38), USB_OTG_AND_HOST (R70.2)
USB_OTG0_P: RK3566_USB_GPIO (U2.R37), USB_OTG_AND_HOST (R71.2)
USB_OTG0_VBUSDET: RK3566_USB_GPIO (C173.1 U2.T38), USB_OTG_AND_HOST (R75.1 R78.2)
WIFI_REG_ON_H: RK3566_FLASH_SD_SARADC (U2.A35), Wi-Fi_BT (U12.12)
WIFI_WAKE_HOST_H: RK3566_FLASH_SD_SARADC (U2.B34), Wi-Fi_BT (U12.13)